# EasyEDA Pro project split-keyboard.eprj

# Schematic Schematic1
Board Name: Left; Create Date: 2025-08-14; Page Name: P1; Project Name: split-keyboard; Schematic Name: Schematic1; Update Date: 2025-09-05; Company: EasyEDA.com; Page Size: A4; Version: V1.0
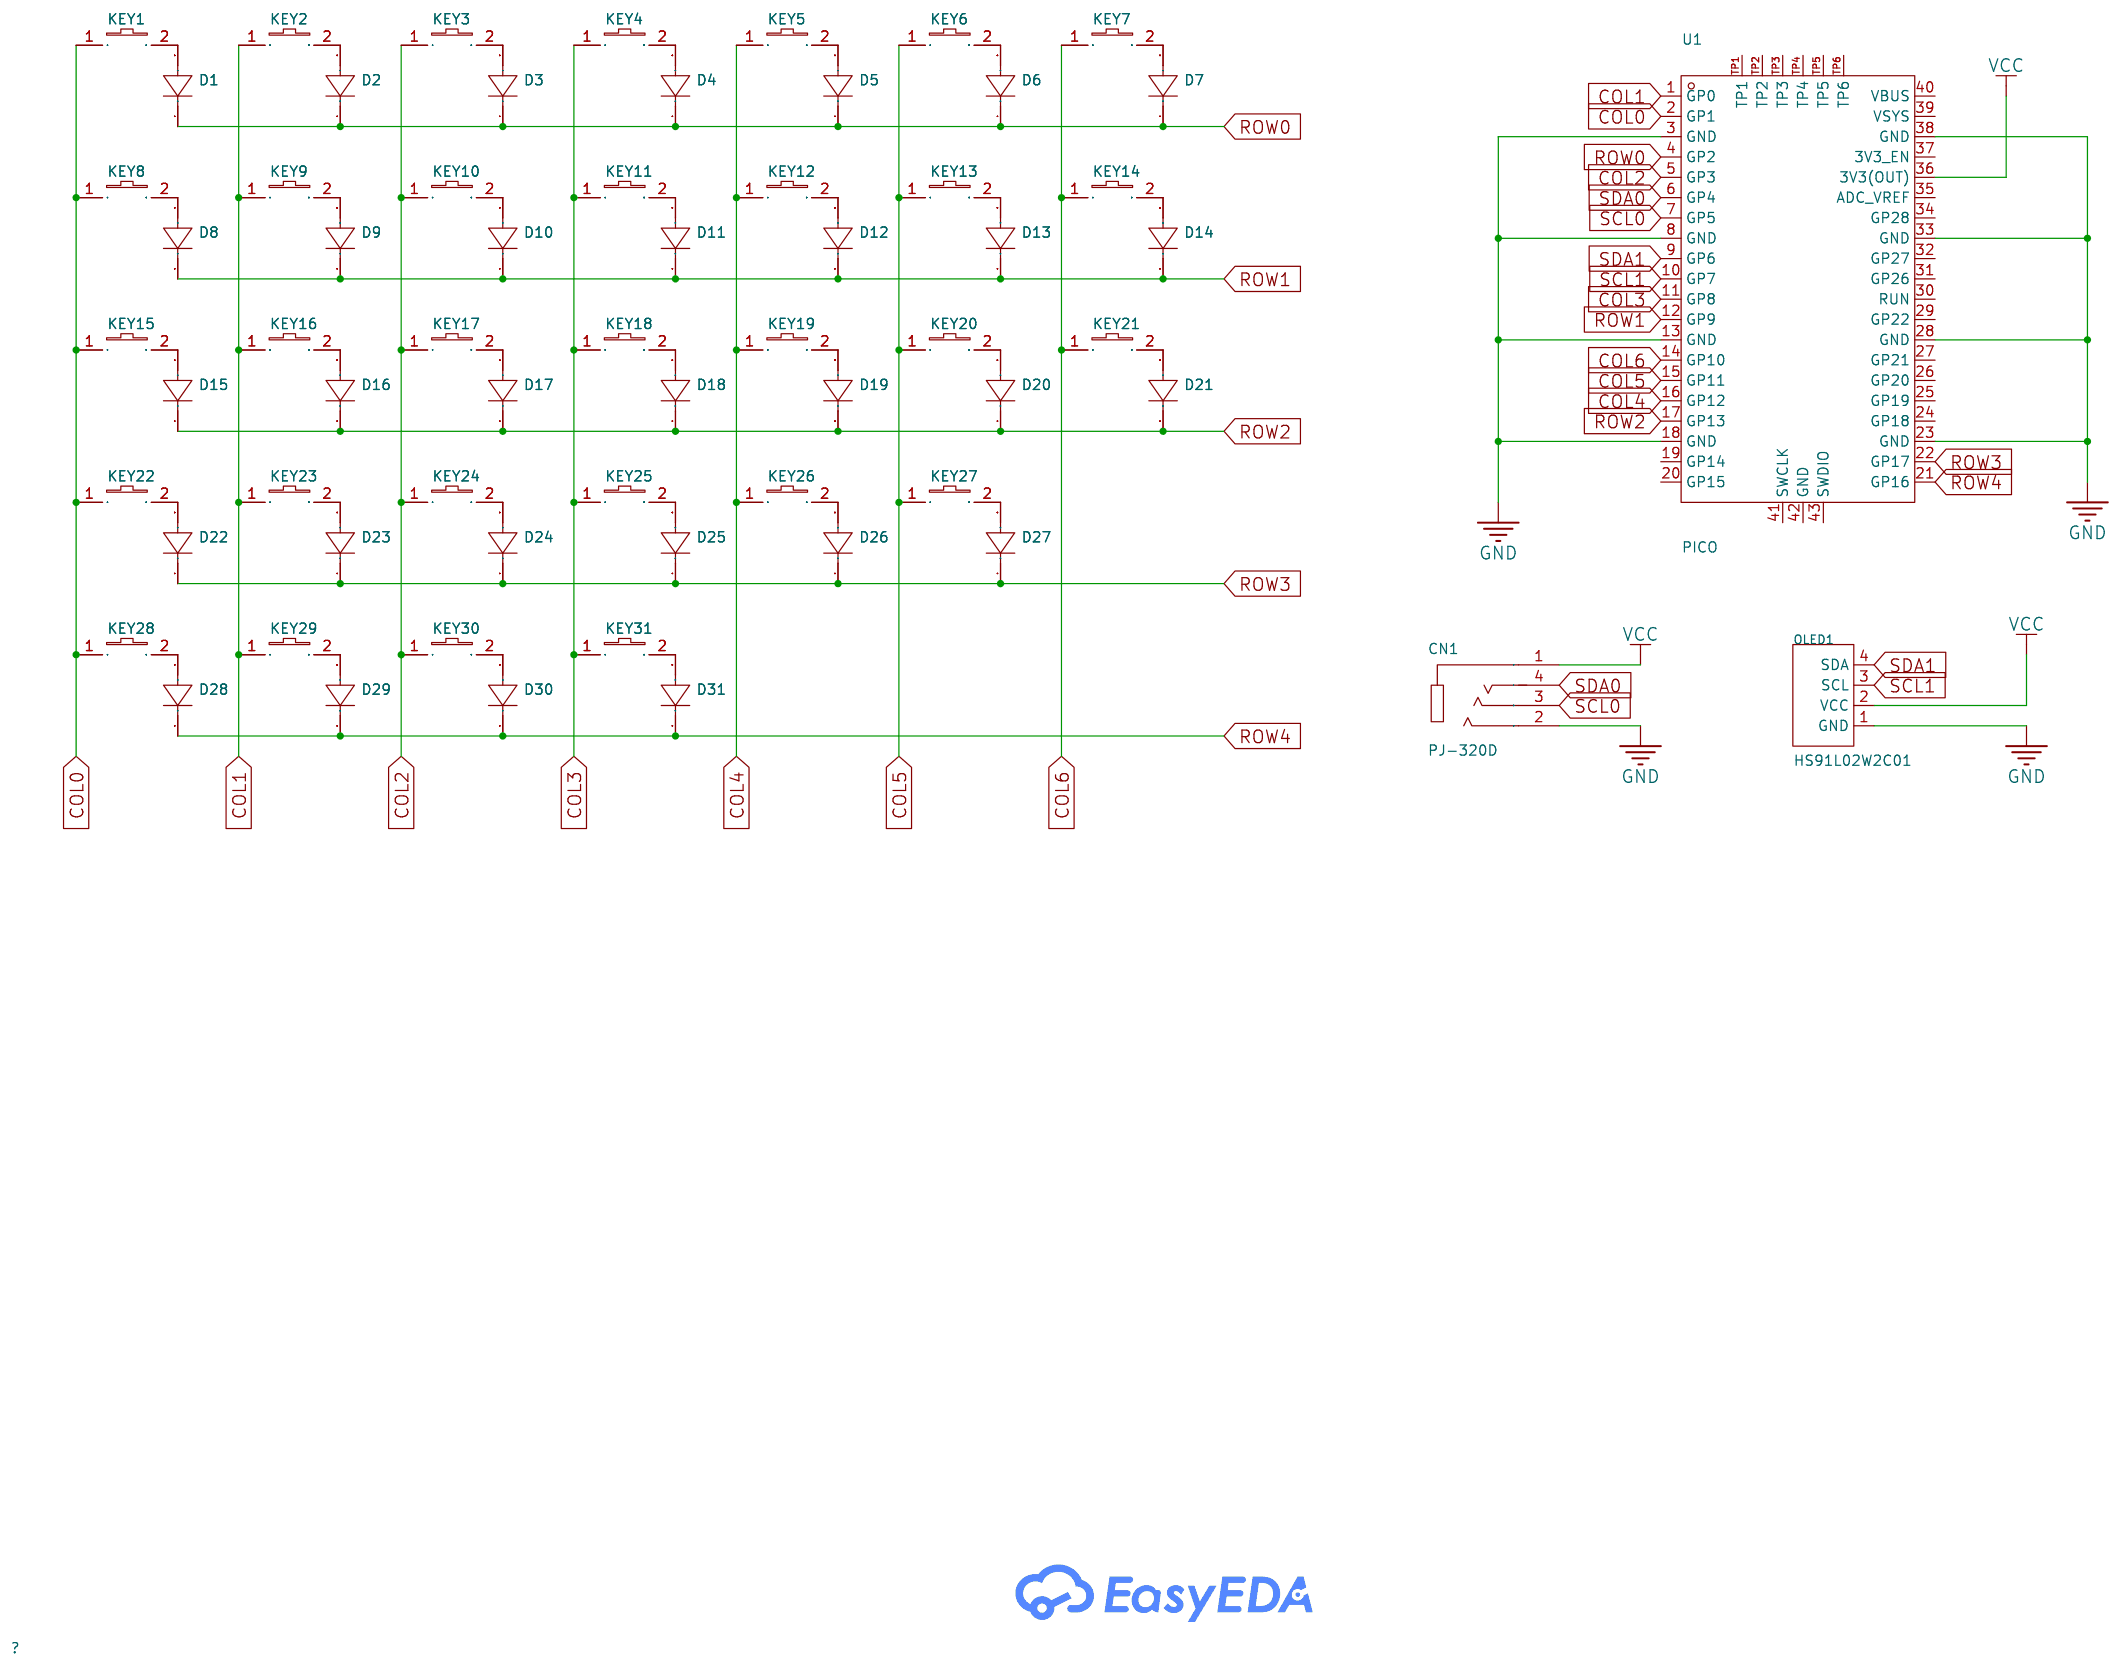
[diagram p0: schematic sheet]

## Parts
CN1  PJ-320D  [AUDIO-SMD_PJ-320D-1]
D1  -  [DO-41_BD2.4-L4.7-P8.70-D0.9-RD]
D2  -  [DO-41_BD2.4-L4.7-P8.70-D0.9-RD]
D3  -  [DO-41_BD2.4-L4.7-P8.70-D0.9-RD]
D4  -  [DO-41_BD2.4-L4.7-P8.70-D0.9-RD]
D5  -  [DO-41_BD2.4-L4.7-P8.70-D0.9-RD]
D6  -  [DO-41_BD2.4-L4.7-P8.70-D0.9-RD]
D7  -  [DO-41_BD2.4-L4.7-P8.70-D0.9-RD]
D8  -  [DO-41_BD2.4-L4.7-P8.70-D0.9-RD]
D9  -  [DO-41_BD2.4-L4.7-P8.70-D0.9-RD]
D10  -  [DO-41_BD2.4-L4.7-P8.70-D0.9-RD]
D11  -  [DO-41_BD2.4-L4.7-P8.70-D0.9-RD]
D12  -  [DO-41_BD2.4-L4.7-P8.70-D0.9-RD]
D13  -  [DO-41_BD2.4-L4.7-P8.70-D0.9-RD]
D14  -  [DO-41_BD2.4-L4.7-P8.70-D0.9-RD]
D15  -  [DO-41_BD2.4-L4.7-P8.70-D0.9-RD]
D16  -  [DO-41_BD2.4-L4.7-P8.70-D0.9-RD]
D17  -  [DO-41_BD2.4-L4.7-P8.70-D0.9-RD]
D18  -  [DO-41_BD2.4-L4.7-P8.70-D0.9-RD]
D19  -  [DO-41_BD2.4-L4.7-P8.70-D0.9-RD]
D20  -  [DO-41_BD2.4-L4.7-P8.70-D0.9-RD]
D21  -  [DO-41_BD2.4-L4.7-P8.70-D0.9-RD]
D22  -  [DO-41_BD2.4-L4.7-P8.70-D0.9-RD]
D23  -  [DO-41_BD2.4-L4.7-P8.70-D0.9-RD]
D24  -  [DO-41_BD2.4-L4.7-P8.70-D0.9-RD]
D25  -  [DO-41_BD2.4-L4.7-P8.70-D0.9-RD]
D26  -  [DO-41_BD2.4-L4.7-P8.70-D0.9-RD]
D27  -  [DO-41_BD2.4-L4.7-P8.70-D0.9-RD]
D28  -  [DO-41_BD2.4-L4.7-P8.70-D0.9-RD]
D29  -  [DO-41_BD2.4-L4.7-P8.70-D0.9-RD]
D30  -  [DO-41_BD2.4-L4.7-P8.70-D0.9-RD]
D31  -  [DO-41_BD2.4-L4.7-P8.70-D0.9-RD]
KEY1  28115182DM  [MX_PCB_1.00u]
KEY2  28115182DM  [MX_PCB_1.00u]
KEY3  28115182DM  [MX_PCB_1.00u]
KEY4  28115182DM  [MX_PCB_1.00u]
KEY5  28115182DM  [MX_PCB_1.00u]
KEY6  28115182DM  [MX_PCB_1.00u]
KEY7  28115182DM  [MX_PCB_1.00u]
KEY8  28115182DM  [MX_PCB_1.00u]
KEY9  28115182DM  [MX_PCB_1.00u]
KEY10  28115182DM  [MX_PCB_1.00u]
KEY11  28115182DM  [MX_PCB_1.00u]
KEY12  28115182DM  [MX_PCB_1.00u]
KEY13  28115182DM  [MX_PCB_1.00u]
KEY14  28115182DM  [MX_PCB_1.00u]
KEY15  28115182DM  [MX_PCB_1.00u]
KEY16  28115182DM  [MX_PCB_1.00u]
KEY17  28115182DM  [MX_PCB_1.00u]
KEY18  28115182DM  [MX_PCB_1.00u]
KEY19  28115182DM  [MX_PCB_1.00u]
KEY20  28115182DM  [MX_PCB_1.00u]
KEY21  28115182DM  [MX_PCB_1.00u]
KEY22  28115182DM  [MX_PCB_1.00u]
KEY23  28115182DM  [MX_PCB_1.00u]
KEY24  28115182DM  [MX_PCB_1.00u]
KEY25  28115182DM  [MX_PCB_1.00u]
KEY26  28115182DM  [MX_PCB_1.00u]
KEY27  28115182DM  [MX_PCB_1.00u]
KEY28  28115182DM  [MX_PCB_1.00u]
KEY29  28115182DM  [MX_PCB_1.00u]
KEY30  28115182DM  [MX_PCB_1.00u]
KEY31  28115182DM  [MX_PCB_1.00u]
OLED1  HS91L02W2C01  [OLED-TH_L38.0-W12.0_HS91L02W2C01]
U1  PICO  [Raspberry_Pi_Pico]

## Library data of the parts
CN1 = PJ-320D_C431535: Connector Type:3.5mm Headphone Jack Current Rating (Max):500mA Voltage Rating (Max):50V Contact Material:Copper Contact Plating:Silver Operating Temperature Range:-30℃~+70℃ Operating Temperature Range:-30℃~+70℃; LCSC Part Name: 3.5mm耳机座; Supplier Part: C431535; Manufacturer: SHOU HAN(首韩); Supplier Footprint: SMD; Datasheet: https://atta.szlcsc.com/upload/public/pdf/source/20190925/C431535_8B274506621F6117FB020BF07A197848.pdf; Supplier: LCSC; Connector Type: 3.5mm Headphone Jack; Current Rating (Max): 500mA; Voltage Rating (Max): 50V; Contact Material: Copper; Contact Plating: Silver; Operating Temperature Range: -30℃~+70℃
D1-D31 = 1N4007: Supplier Footprint: DO-41
KEY1-KEY31 = 28115182DM: Axis Type:水晶轴 Number of Pins:2 Life:5000万次 Operation Force:60gf Conduction Travel:- Voltage Rating:- Operating Temperature:-10℃~+70℃ Operating Temperature:-10℃~+70℃; Supplier Part: C47121945; Manufacturer: SAMZO(三佐); Supplier Footprint: 插件; JLCPCB Part Class: Extended Part; Datasheet: https://atta.szlcsc.com/upload/public/pdf/source/20250402/8399631E7C857A557AEE3DBE24222DC8.pdf; Supplier: LCSC; Axis Type: 水晶轴; Number of Pins: 2; Life: 5000万次; Operation Force: 60gf; Operating Temperature: -10℃~+70℃
OLED1 = HS91L02W2C01: LCSC Part Name: 0.91寸OLED显示屏白光IIC; Supplier Part: C5248081; Manufacturer: HS(汉昇); JLCPCB Part Class: Extended Part; Datasheet: https://atta.szlcsc.com/upload/public/pdf/source/20230727/C3E43C8E3DDA847F5681FEE7D95C153D.pdf; Supplier: LCSC; Main Control Chip: SSD1306; Interface Type: I2C; Size: 0.91; Pixel Resolution: 128x32; Operating Temperature: -40℃~+70℃
U1 = PICO: Supplier Part: C7203002; Manufacturer: Raspberry Pi(树莓派); Datasheet: https://atta.szlcsc.com/upload/public/pdf/source/20230906/086376002DDC9866828648BC93E51F8B.pdf; Supplier: LCSC

## Nets
GND: CN1.2 OLED1.1(GND) U1.3(GND) U1.8(GND) U1.13(GND) U1.18(GND) U1.23(GND) U1.28(GND) U1.33(GND) U1.38(GND)
VCC: CN1.1 OLED1.2(VCC) U1.36(3V3(OUT))
COL0: KEY1.1 KEY8.1 KEY15.1 KEY22.1 KEY28.1 U1.2(GP1)
COL1: KEY2.1 KEY9.1 KEY16.1 KEY23.1 KEY29.1 U1.1(GP0)
COL2: KEY3.1 KEY10.1 KEY17.1 KEY24.1 KEY30.1 U1.5(GP3)
COL3: KEY4.1 KEY11.1 KEY18.1 KEY25.1 KEY31.1 U1.11(GP8)
COL4: KEY5.1 KEY12.1 KEY19.1 KEY26.1 U1.16(GP12)
COL5: KEY6.1 KEY13.1 KEY20.1 KEY27.1 U1.15(GP11)
COL6: KEY7.1 KEY14.1 KEY21.1 U1.14(GP10)
ROW0: D1.1(K) D2.1(K) D3.1(K) D4.1(K) D5.1(K) D6.1(K) D7.1(K) U1.4(GP2)
ROW1: D8.1(K) D9.1(K) D10.1(K) D11.1(K) D12.1(K) D13.1(K) D14.1(K) U1.12(GP9)
ROW2: D15.1(K) D16.1(K) D17.1(K) D18.1(K) D19.1(K) D20.1(K) D21.1(K) U1.17(GP13)
ROW3: D22.1(K) D23.1(K) D24.1(K) D25.1(K) D26.1(K) D27.1(K) U1.22(GP17)
ROW4: D28.1(K) D29.1(K) D30.1(K) D31.1(K) U1.21(GP16)
SCL0: CN1.3 U1.7(GP5)
SCL1: OLED1.3(SCL) U1.10(GP7)
SDA0: CN1.4 U1.6(GP4)
SDA1: OLED1.4(SDA) U1.9(GP6)
$1N158: D1.2(A) KEY1.2
$1N243: D2.2(A) KEY2.2
$1N305: D3.2(A) KEY3.2
$1N549: D4.2(A) KEY4.2
$1N551: D5.2(A) KEY5.2
$1N553: D6.2(A) KEY6.2
$1N987: D7.2(A) KEY7.2
$1N1409: D8.2(A) KEY8.2
$1N1411: D9.2(A) KEY9.2
$1N1413: D10.2(A) KEY10.2
$1N1415: D11.2(A) KEY11.2
$1N1417: D12.2(A) KEY12.2
$1N1419: D13.2(A) KEY13.2
$1N1421: D14.2(A) KEY14.2
$1N1843: D15.2(A) KEY15.2
$1N1845: D16.2(A) KEY16.2
$1N1847: D17.2(A) KEY17.2
$1N1849: D18.2(A) KEY18.2
$1N1851: D19.2(A) KEY19.2
$1N1853: D20.2(A) KEY20.2
$1N1855: D21.2(A) KEY21.2
$1N2217: D22.2(A) KEY22.2
$1N2219: D23.2(A) KEY23.2
$1N2221: D24.2(A) KEY24.2
$1N2223: D25.2(A) KEY25.2
$1N2225: D26.2(A) KEY26.2
$1N2227: D27.2(A) KEY27.2
$1N2529: D28.2(A) KEY28.2
$1N2531: D29.2(A) KEY29.2
$1N4626: D30.2(A) KEY30.2
$1N4628: D31.2(A) KEY31.2

Not connected (* = marked no-connect by the designer): U1 19(GP14) 20(GP15) 24(GP18) 25(GP19) 26(GP20) 27(GP21) 29(GP22) 30(RUN) 31(GP26) 32(GP27) 34(GP28) 35(ADC_VREF) 37(3V3_EN) 39(VSYS) 40(VBUS) 41(SWCLK) 42(GND) 43(SWDIO) TP1 TP2 TP3 TP4 TP5 TP6

# Schematic Schematic2
Board Name: Right; Create Date: 2025-09-15; Page Name: P1; Project Name: split-keyboard; Schematic Name: Schematic2; Update Date: 2025-09-16; Company: EasyEDA.com; Page Size: A4; Version: V1.0
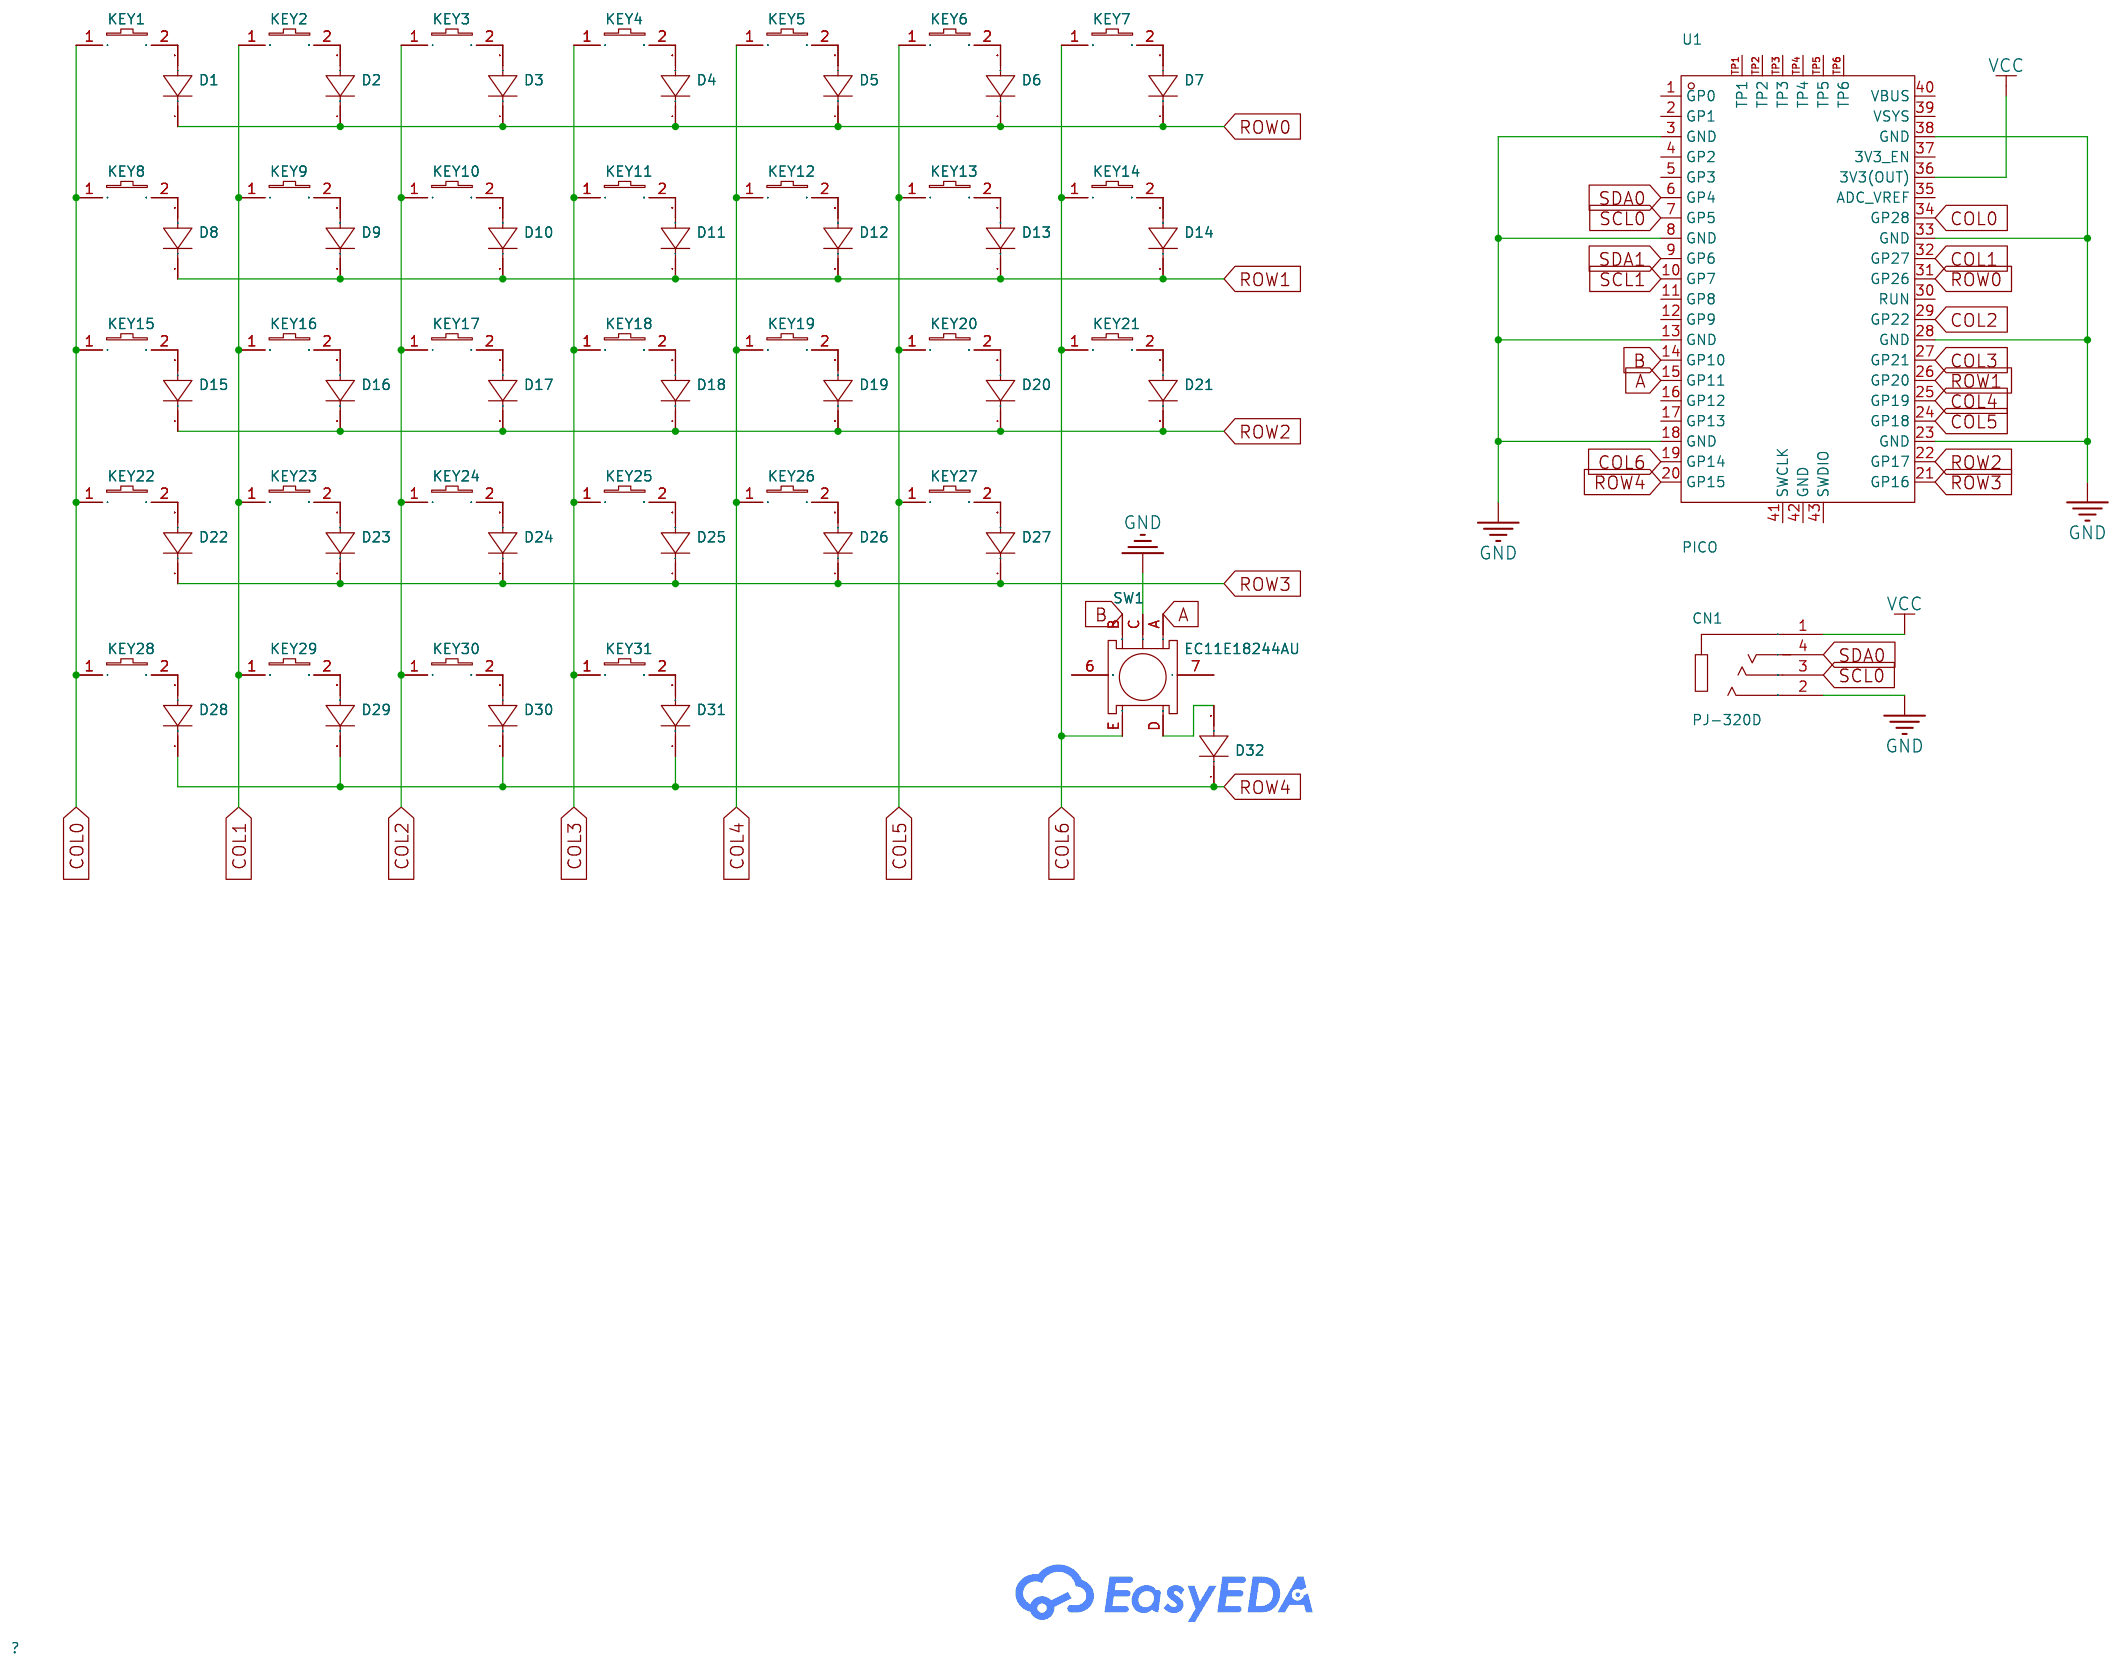
[diagram p1: schematic sheet]

## Parts
CN1  PJ-320D  [AUDIO-SMD_PJ-320D-1]
D1  -  [DO-41_BD2.4-L4.7-P8.70-D0.9-RD]
D2  -  [DO-41_BD2.4-L4.7-P8.70-D0.9-RD]
D3  -  [DO-41_BD2.4-L4.7-P8.70-D0.9-RD]
D4  -  [DO-41_BD2.4-L4.7-P8.70-D0.9-RD]
D5  -  [DO-41_BD2.4-L4.7-P8.70-D0.9-RD]
D6  -  [DO-41_BD2.4-L4.7-P8.70-D0.9-RD]
D7  -  [DO-41_BD2.4-L4.7-P8.70-D0.9-RD]
D8  -  [DO-41_BD2.4-L4.7-P8.70-D0.9-RD]
D9  -  [DO-41_BD2.4-L4.7-P8.70-D0.9-RD]
D10  -  [DO-41_BD2.4-L4.7-P8.70-D0.9-RD]
D11  -  [DO-41_BD2.4-L4.7-P8.70-D0.9-RD]
D12  -  [DO-41_BD2.4-L4.7-P8.70-D0.9-RD]
D13  -  [DO-41_BD2.4-L4.7-P8.70-D0.9-RD]
D14  -  [DO-41_BD2.4-L4.7-P8.70-D0.9-RD]
D15  -  [DO-41_BD2.4-L4.7-P8.70-D0.9-RD]
D16  -  [DO-41_BD2.4-L4.7-P8.70-D0.9-RD]
D17  -  [DO-41_BD2.4-L4.7-P8.70-D0.9-RD]
D18  -  [DO-41_BD2.4-L4.7-P8.70-D0.9-RD]
D19  -  [DO-41_BD2.4-L4.7-P8.70-D0.9-RD]
D20  -  [DO-41_BD2.4-L4.7-P8.70-D0.9-RD]
D21  -  [DO-41_BD2.4-L4.7-P8.70-D0.9-RD]
D22  -  [DO-41_BD2.4-L4.7-P8.70-D0.9-RD]
D23  -  [DO-41_BD2.4-L4.7-P8.70-D0.9-RD]
D24  -  [DO-41_BD2.4-L4.7-P8.70-D0.9-RD]
D25  -  [DO-41_BD2.4-L4.7-P8.70-D0.9-RD]
D26  -  [DO-41_BD2.4-L4.7-P8.70-D0.9-RD]
D27  -  [DO-41_BD2.4-L4.7-P8.70-D0.9-RD]
D28  -  [DO-41_BD2.4-L4.7-P8.70-D0.9-RD]
D29  -  [DO-41_BD2.4-L4.7-P8.70-D0.9-RD]
D30  -  [DO-41_BD2.4-L4.7-P8.70-D0.9-RD]
D31  -  [DO-41_BD2.4-L4.7-P8.70-D0.9-RD]
D32  -  [DO-41_BD2.4-L4.7-P8.70-D0.9-RD]
KEY1  28115182DM  [MX_PCB_1.00u]
KEY2  28115182DM  [MX_PCB_1.00u]
KEY3  28115182DM  [MX_PCB_1.00u]
KEY4  28115182DM  [MX_PCB_1.00u]
KEY5  28115182DM  [MX_PCB_1.00u]
KEY6  28115182DM  [MX_PCB_1.00u]
KEY7  28115182DM  [MX_PCB_1.00u]
KEY8  28115182DM  [MX_PCB_1.00u]
KEY9  28115182DM  [MX_PCB_1.00u]
KEY10  28115182DM  [MX_PCB_1.00u]
KEY11  28115182DM  [MX_PCB_1.00u]
KEY12  28115182DM  [MX_PCB_1.00u]
KEY13  28115182DM  [MX_PCB_1.00u]
KEY14  28115182DM  [MX_PCB_1.00u]
KEY15  28115182DM  [MX_PCB_1.00u]
KEY16  28115182DM  [MX_PCB_1.00u]
KEY17  28115182DM  [MX_PCB_1.00u]
KEY18  28115182DM  [MX_PCB_1.00u]
KEY19  28115182DM  [MX_PCB_1.00u]
KEY20  28115182DM  [MX_PCB_1.00u]
KEY21  28115182DM  [MX_PCB_1.00u]
KEY22  28115182DM  [MX_PCB_1.00u]
KEY23  28115182DM  [MX_PCB_1.00u]
KEY24  28115182DM  [MX_PCB_1.00u]
KEY25  28115182DM  [MX_PCB_1.00u]
KEY26  28115182DM  [MX_PCB_1.00u]
KEY27  28115182DM  [MX_PCB_1.00u]
KEY28  28115182DM  [MX_PCB_1.00u]
KEY29  28115182DM  [MX_PCB_1.00u]
KEY30  28115182DM  [MX_PCB_1.00u]
KEY31  28115182DM  [MX_PCB_1.00u]
SW1  EC11E18244AU  [SW-TH_EC11XXXXXXXX]
U1  PICO  [Raspberry_Pi_Pico]

## Library data of the parts
CN1 = PJ-320D_C431535: Connector Type:3.5mm Headphone Jack Current Rating (Max):500mA Voltage Rating (Max):50V Contact Material:Copper Contact Plating:Silver Operating Temperature Range:-30℃~+70℃ Operating Temperature Range:-30℃~+70℃; LCSC Part Name: 3.5mm耳机座; Supplier Part: C431535; Manufacturer: SHOU HAN(首韩); Supplier Footprint: SMD; Datasheet: https://atta.szlcsc.com/upload/public/pdf/source/20190925/C431535_8B274506621F6117FB020BF07A197848.pdf; Supplier: LCSC; Connector Type: 3.5mm Headphone Jack; Current Rating (Max): 500mA; Voltage Rating (Max): 50V; Contact Material: Copper; Contact Plating: Silver; Operating Temperature Range: -30℃~+70℃
D1-D32 = 1N4007: Supplier Footprint: DO-41
KEY1-KEY31 = 28115182DM: Axis Type:水晶轴 Number of Pins:2 Life:5000万次 Operation Force:60gf Conduction Travel:- Voltage Rating:- Operating Temperature:-10℃~+70℃ Operating Temperature:-10℃~+70℃; Supplier Part: C47121945; Manufacturer: SAMZO(三佐); Supplier Footprint: 插件; JLCPCB Part Class: Extended Part; Datasheet: https://atta.szlcsc.com/upload/public/pdf/source/20250402/8399631E7C857A557AEE3DBE24222DC8.pdf; Supplier: LCSC; Axis Type: 水晶轴; Number of Pins: 2; Life: 5000万次; Operation Force: 60gf; Operating Temperature: -10℃~+70℃
SW1 = EC11E18244AU: Supplier Part: C202365; Manufacturer: ALPSALPINE(阿尔卑斯阿尔派); Supplier Footprint: 插件; Datasheet: https://atta.szlcsc.com/upload/public/pdf/source/20180403/C202365_70FA927E879F562641EADC151E1E414A.pdf; Supplier: LCSC
U1 = PICO: Supplier Part: C7203002; Manufacturer: Raspberry Pi(树莓派); Datasheet: https://atta.szlcsc.com/upload/public/pdf/source/20230906/086376002DDC9866828648BC93E51F8B.pdf; Supplier: LCSC

## Nets
GND: CN1.2 SW1.C U1.3(GND) U1.8(GND) U1.13(GND) U1.18(GND) U1.23(GND) U1.28(GND) U1.33(GND) U1.38(GND)
VCC: CN1.1 U1.36(3V3(OUT))
A: SW1.A U1.15(GP11)
B: SW1.B U1.14(GP10)
COL0: KEY1.1 KEY8.1 KEY15.1 KEY22.1 KEY28.1 U1.34(GP28)
COL1: KEY2.1 KEY9.1 KEY16.1 KEY23.1 KEY29.1 U1.32(GP27)
COL2: KEY3.1 KEY10.1 KEY17.1 KEY24.1 KEY30.1 U1.29(GP22)
COL3: KEY4.1 KEY11.1 KEY18.1 KEY25.1 KEY31.1 U1.27(GP21)
COL4: KEY5.1 KEY12.1 KEY19.1 KEY26.1 U1.25(GP19)
COL5: KEY6.1 KEY13.1 KEY20.1 KEY27.1 U1.24(GP18)
COL6: KEY7.1 KEY14.1 KEY21.1 SW1.E U1.19(GP14)
ROW0: D1.1(K) D2.1(K) D3.1(K) D4.1(K) D5.1(K) D6.1(K) D7.1(K) U1.31(GP26)
ROW1: D8.1(K) D9.1(K) D10.1(K) D11.1(K) D12.1(K) D13.1(K) D14.1(K) U1.26(GP20)
ROW2: D15.1(K) D16.1(K) D17.1(K) D18.1(K) D19.1(K) D20.1(K) D21.1(K) U1.22(GP17)
ROW3: D22.1(K) D23.1(K) D24.1(K) D25.1(K) D26.1(K) D27.1(K) U1.21(GP16)
ROW4: D28.1(K) D29.1(K) D30.1(K) D31.1(K) D32.1(K) U1.20(GP15)
SCL0: CN1.3 U1.7(GP5)
SCL1: U1.10(GP7)
SDA0: CN1.4 U1.6(GP4)
SDA1: U1.9(GP6)
$1N158: D1.2(A) KEY1.2
$1N243: D2.2(A) KEY2.2
$1N305: D3.2(A) KEY3.2
$1N549: D4.2(A) KEY4.2
$1N551: D5.2(A) KEY5.2
$1N553: D6.2(A) KEY6.2
$1N987: D7.2(A) KEY7.2
$1N1409: D8.2(A) KEY8.2
$1N1411: D9.2(A) KEY9.2
$1N1413: D10.2(A) KEY10.2
$1N1415: D11.2(A) KEY11.2
$1N1417: D12.2(A) KEY12.2
$1N1419: D13.2(A) KEY13.2
$1N1421: D14.2(A) KEY14.2
$1N1843: D15.2(A) KEY15.2
$1N1845: D16.2(A) KEY16.2
$1N1847: D17.2(A) KEY17.2
$1N1849: D18.2(A) KEY18.2
$1N1851: D19.2(A) KEY19.2
$1N1853: D20.2(A) KEY20.2
$1N1855: D21.2(A) KEY21.2
$1N2217: D22.2(A) KEY22.2
$1N2219: D23.2(A) KEY23.2
$1N2221: D24.2(A) KEY24.2
$1N2223: D25.2(A) KEY25.2
$1N2225: D26.2(A) KEY26.2
$1N2227: D27.2(A) KEY27.2
$1N2529: D28.2(A) KEY28.2
$1N2531: D29.2(A) KEY29.2
$1N4626: D30.2(A) KEY30.2
$1N4628: D31.2(A) KEY31.2
$1N26639: D32.2(A) SW1.D

Not connected (* = marked no-connect by the designer): SW1 6 7; U1 1(GP0) 2(GP1) 4(GP2) 5(GP3) 11(GP8) 12(GP9) 16(GP12) 17(GP13) 30(RUN) 35(ADC_VREF) 37(3V3_EN) 39(VSYS) 40(VBUS) 41(SWCLK) 42(GND) 43(SWDIO) TP1 TP2 TP3 TP4 TP5 TP6

# Board PCB2
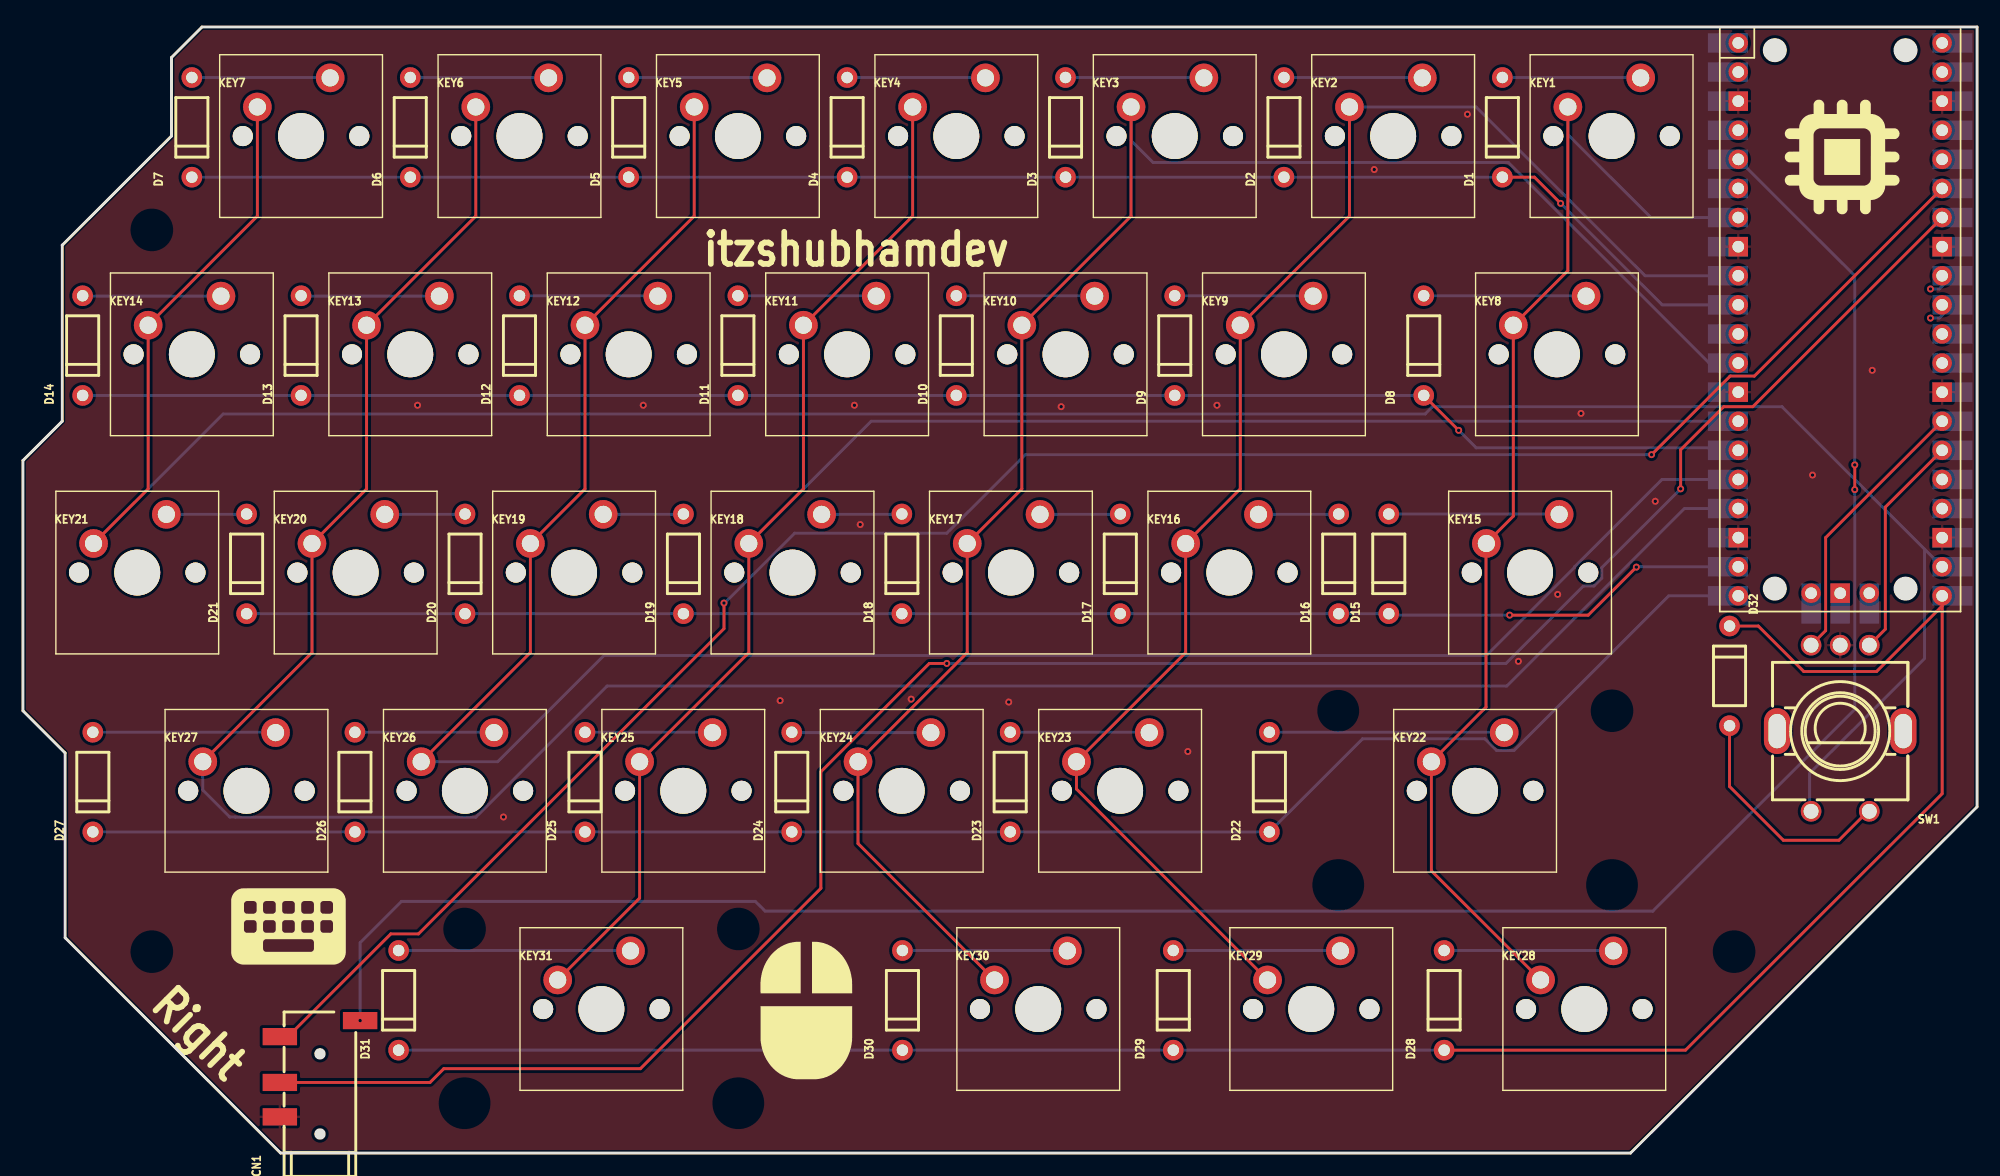
[diagram p2: board, top side]
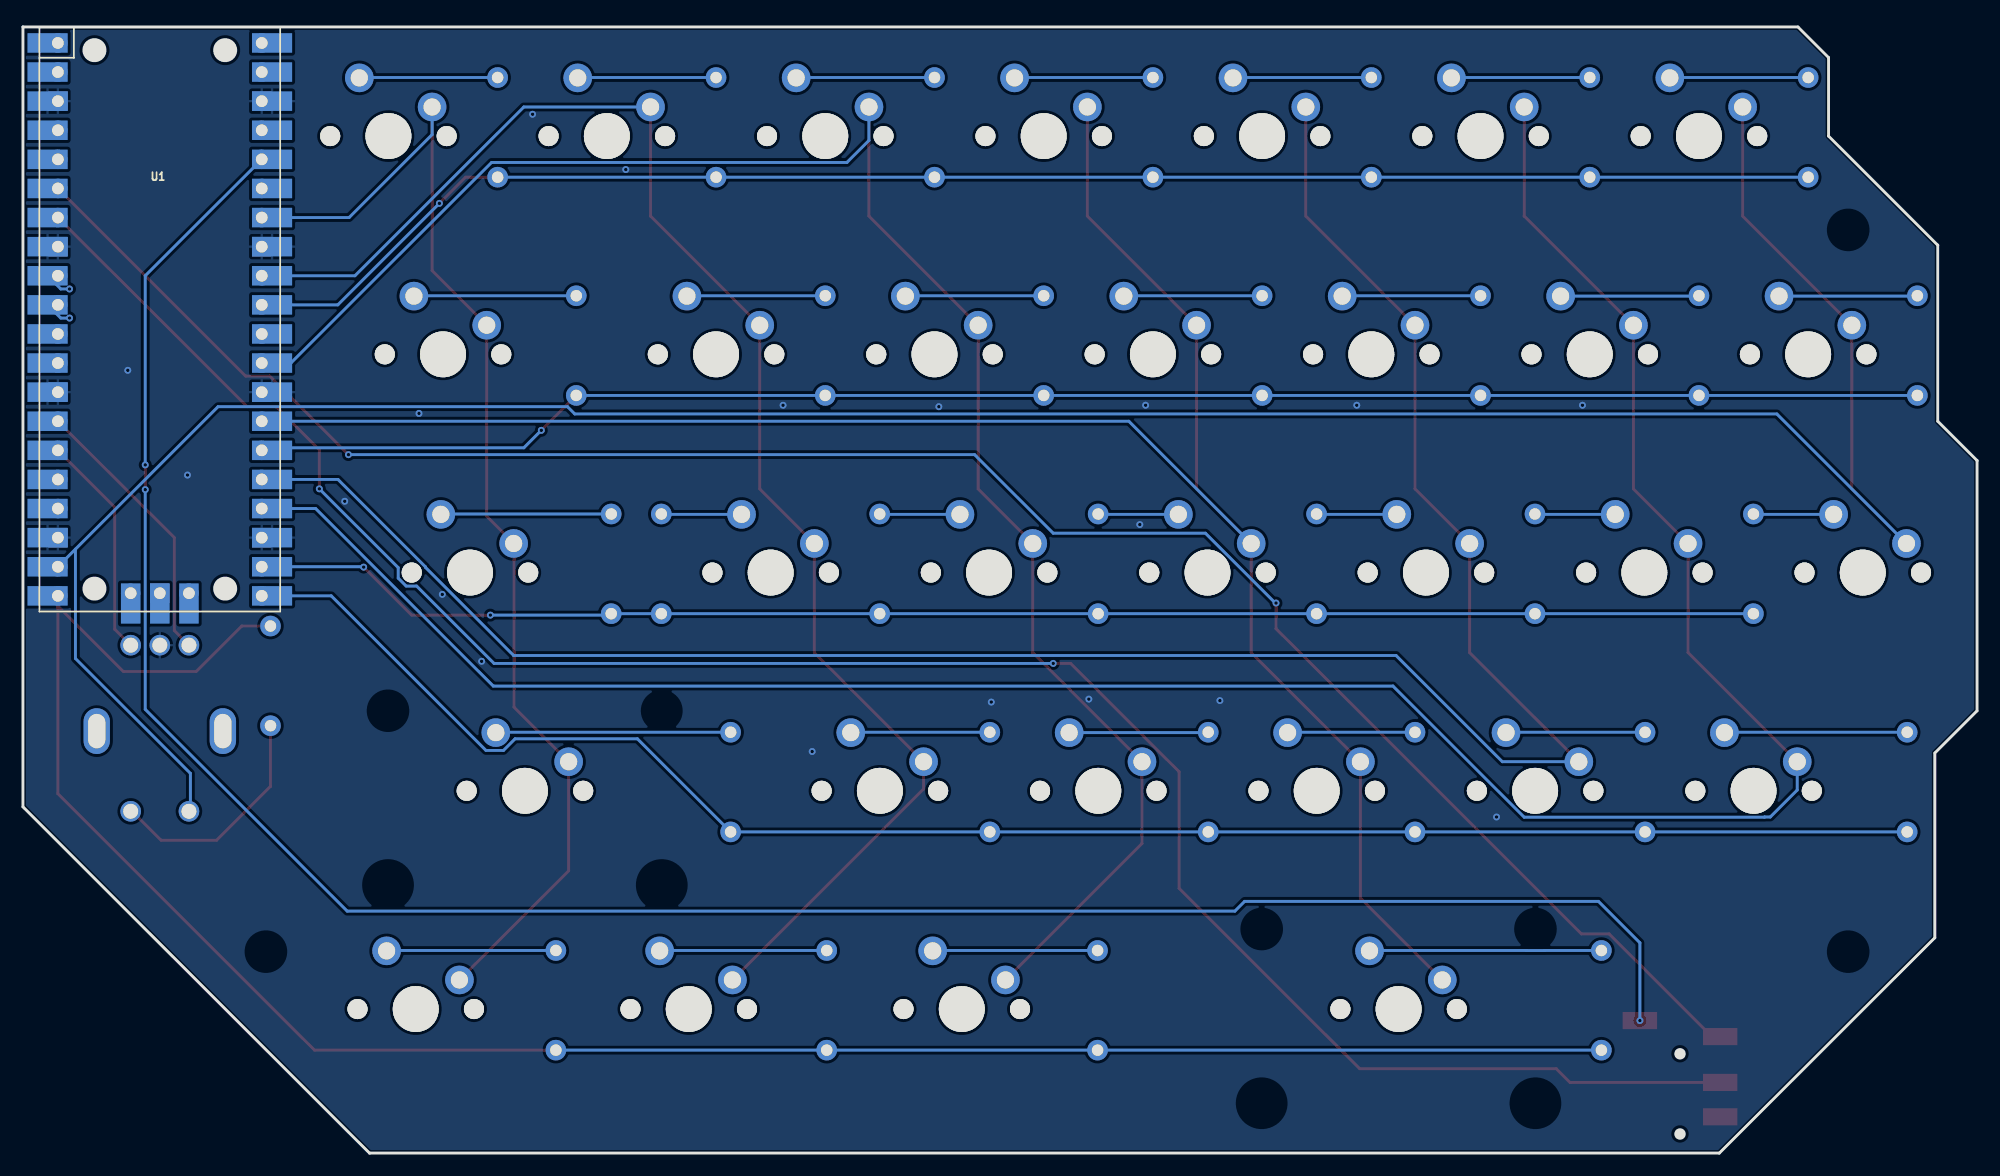
[diagram p3: board, bottom side, seen from below]

Outline 170.43 x 98.3 mm; copper layers: Top Layer, Bottom Layer. Coordinates in mm from the lower left corner of the outline.
Outline path: 0,60.45 0,38.61 3.68,34.92 3.68,18.8 22.48,0 140.21,0 170.43,30.23 170.43,98.3 15.62,98.3 12.95,95.63 12.95,88.77 3.43,79.25 3.43,63.88 0,60.45
Stack: Top Layer 0.035mm / Dielectric1 1.51mm FR4 er 4.5 / Bottom Layer 0.035mm

## Design rules (mm)
template: JLCPCB Capability(Two Layers Board)
spacing copperThickness1oz (default): track to track 0.102, other pairs 0.152 to 0.3
spacing copperThickness2oz: track to track 0.203, other pairs 0.152 to 0.3
track width copperThickness1oz (default): min 0.127, default 0.254, max 2.54
track width copperThickness2oz: min 0.203, default 0.254, max 2.54
differential pair differentialPair (default): width min 0.127, default 0.254, max 2.54; gap min 0.152, default 0.152
via viaSize (default): diameter min 0.5, default 0.61, max 10; hole min 0.3, default 0.305, max 6.3

## Placement (name value [footprint] x y rotation side)
CN1  PJ-320D  [AUDIO-SMD_PJ-320D-1]  25.91 7.37 90 top
D1  -  [DO-41_BD2.4-L4.7-P8.70-D0.9-RD]  129.03 89.53 90 top
D2  -  [DO-41_BD2.4-L4.7-P8.70-D0.9-RD]  109.98 89.53 90 top
D3  -  [DO-41_BD2.4-L4.7-P8.70-D0.9-RD]  90.93 89.53 90 top
D4  -  [DO-41_BD2.4-L4.7-P8.70-D0.9-RD]  71.88 89.53 90 top
D5  -  [DO-41_BD2.4-L4.7-P8.70-D0.9-RD]  52.83 89.53 90 top
D6  -  [DO-41_BD2.4-L4.7-P8.70-D0.9-RD]  33.78 89.53 90 top
D7  -  [DO-41_BD2.4-L4.7-P8.70-D0.9-RD]  14.73 89.53 90 top
D8  -  [DO-41_BD2.4-L4.7-P8.70-D0.9-RD]  122.17 70.48 90 top
D9  -  [DO-41_BD2.4-L4.7-P8.70-D0.9-RD]  100.46 70.48 90 top
D10  -  [DO-41_BD2.4-L4.7-P8.70-D0.9-RD]  81.41 70.48 90 top
D11  -  [DO-41_BD2.4-L4.7-P8.70-D0.9-RD]  62.36 70.48 90 top
D12  -  [DO-41_BD2.4-L4.7-P8.70-D0.9-RD]  43.31 70.48 90 top
D13  -  [DO-41_BD2.4-L4.7-P8.70-D0.9-RD]  24.26 70.48 90 top
D14  -  [DO-41_BD2.4-L4.7-P8.70-D0.9-RD]  5.21 70.48 90 top
D15  -  [DO-41_BD2.4-L4.7-P8.70-D0.9-RD]  119.13 51.44 90 top
D16  -  [DO-41_BD2.4-L4.7-P8.70-D0.9-RD]  114.76 51.44 90 top
D17  -  [DO-41_BD2.4-L4.7-P8.70-D0.9-RD]  95.71 51.44 90 top
D18  -  [DO-41_BD2.4-L4.7-P8.70-D0.9-RD]  76.66 51.44 90 top
D19  -  [DO-41_BD2.4-L4.7-P8.70-D0.9-RD]  57.61 51.44 90 top
D20  -  [DO-41_BD2.4-L4.7-P8.70-D0.9-RD]  38.56 51.44 90 top
D21  -  [DO-41_BD2.4-L4.7-P8.70-D0.9-RD]  19.51 51.44 90 top
D22  -  [DO-41_BD2.4-L4.7-P8.70-D0.9-RD]  108.71 32.39 90 top
D23  -  [DO-41_BD2.4-L4.7-P8.70-D0.9-RD]  86.11 32.39 90 top
D24  -  [DO-41_BD2.4-L4.7-P8.70-D0.9-RD]  67.06 32.39 90 top
D25  -  [DO-41_BD2.4-L4.7-P8.70-D0.9-RD]  49.02 32.39 90 top
D26  -  [DO-41_BD2.4-L4.7-P8.70-D0.9-RD]  28.96 32.39 90 top
D27  -  [DO-41_BD2.4-L4.7-P8.70-D0.9-RD]  6.1 32.39 90 top
D28  -  [DO-41_BD2.4-L4.7-P8.70-D0.9-RD]  123.95 13.34 90 top
D29  -  [DO-41_BD2.4-L4.7-P8.70-D0.9-RD]  100.33 13.34 90 top
D30  -  [DO-41_BD2.4-L4.7-P8.70-D0.9-RD]  76.71 13.34 90 top
D31  -  [DO-41_BD2.4-L4.7-P8.70-D0.9-RD]  32.77 13.34 90 top
D32  -  [DO-41_BD2.4-L4.7-P8.70-D0.9-RD]  148.84 41.66 270 top
KEY1  28115182DM  [MX_PCB_1.00u]  138.56 88.77 0 top
KEY2  28115182DM  [MX_PCB_1.00u]  119.51 88.77 0 top
KEY3  28115182DM  [MX_PCB_1.00u]  100.46 88.77 0 top
KEY4  28115182DM  [MX_PCB_1.00u]  81.41 88.77 0 top
KEY5  28115182DM  [MX_PCB_1.00u]  62.36 88.77 0 top
KEY6  28115182DM  [MX_PCB_1.00u]  43.31 88.77 0 top
KEY7  28115182DM  [MX_PCB_1.00u]  24.26 88.77 0 top
KEY8  28115182DM  [MX_PCB_1.00u]  133.79 69.72 0 top
KEY9  28115182DM  [MX_PCB_1.00u]  109.98 69.72 0 top
KEY10  28115182DM  [MX_PCB_1.00u]  90.93 69.72 0 top
KEY11  28115182DM  [MX_PCB_1.00u]  71.88 69.72 0 top
KEY12  28115182DM  [MX_PCB_1.00u]  52.83 69.72 0 top
KEY13  28115182DM  [MX_PCB_1.00u]  33.78 69.72 0 top
KEY14  28115182DM  [MX_PCB_1.00u]  14.73 69.72 0 top
KEY15  28115182DM  [MX_PCB_1.00u]  131.44 50.67 0 top
KEY16  28115182DM  [MX_PCB_1.00u]  105.22 50.67 0 top
KEY17  28115182DM  [MX_PCB_1.00u]  86.17 50.67 0 top
KEY18  28115182DM  [MX_PCB_1.00u]  67.12 50.67 0 top
KEY19  28115182DM  [MX_PCB_1.00u]  48.07 50.67 0 top
KEY20  28115182DM  [MX_PCB_1.00u]  29.02 50.67 0 top
KEY21  28115182DM  [MX_PCB_1.00u]  9.97 50.67 0 top
KEY22  28115182DM  [MX_PCB_1.00u]  126.65 31.62 0 top
KEY23  28115182DM  [MX_PCB_1.00u]  95.69 31.62 0 top
KEY24  28115182DM  [MX_PCB_1.00u]  76.64 31.62 0 top
KEY25  28115182DM  [MX_PCB_1.00u]  57.59 31.62 0 top
KEY26  28115182DM  [MX_PCB_1.00u]  38.54 31.62 0 top
KEY27  28115182DM  [MX_PCB_1.00u]  19.49 31.62 0 top
KEY28  28115182DM  [MX_PCB_1.00u]  136.18 12.57 0 top
KEY29  28115182DM  [MX_PCB_1.00u]  112.36 12.57 0 top
KEY30  28115182DM  [MX_PCB_1.00u]  88.55 12.57 0 top
KEY31  28115182DM  [MX_PCB_1.00u]  50.45 12.57 0 top
SW1  EC11E18244AU  [SW-TH_EC11XXXXXXXX]  158.5 37.08 180 top
U1  PICO  [Raspberry_Pi_Pico]  158.5 72.77 180 bottom

## Footprints (pads in the part's own frame, mm; a bottom-side part is the same pattern mirrored in y, then rotated)
AUDIO-SMD_PJ-320D-1
  rect 1.5x3 smd: 1(4.2,-3.5) 2(-4.2,3.5) 3(-1.2,3.5) 4(2.8,3.5)
DO-41_BD2.4-L4.7-P8.70-D0.9-RD
  round 1.8 hole 1: 1(-4.35,0) 2(4.35,0)
MX_PCB_1.00u
  round 1.75 hole 1.75: (-5.08,0) (5.08,0)
  round 4 hole 4: (0,0)
  round 2.5 hole 1.5: 1(-3.81,2.54) 2(2.54,5.08)
Raspberry_Pi_Pico
  rect 3.5x1.7 smd: 1(-9.79,24.13) 2(-9.79,21.59) 3(-9.79,19.05) 4(-9.79,16.51) 5(-9.79,13.97) 6(-9.79,11.43) 7(-9.79,8.89) 8(-9.79,6.35) 9(-9.79,3.81) 10(-9.79,1.27) 11(-9.79,-1.27) 12(-9.79,-3.81) 13(-9.79,-6.35) 14(-9.79,-8.89) 15(-9.79,-11.43) 16(-9.79,-13.97) 17(-9.79,-16.51) 18(-9.79,-19.05) 19(-9.79,-21.59) 20(-9.79,-24.13) 21(9.79,-24.13) 22(9.79,-21.59) 23(9.79,-19.05) 24(9.79,-16.51) 25(9.79,-13.97) 26(9.79,-11.43) 27(9.79,-8.89) 28(9.79,-6.35) 29(9.79,-3.81) 30(9.79,-1.27) 31(9.79,1.27) 32(9.79,3.81) 33(9.79,6.35) 34(9.79,8.89) 35(9.79,11.43) 36(9.79,13.97) 37(9.79,16.51) 38(9.79,19.05) 39(9.79,21.59) 40(9.79,24.13)
  round 1.7 hole 1.02: 1(-8.89,24.13) 2(-8.89,21.59) 4(-8.89,16.51) 5(-8.89,13.97) 6(-8.89,11.43) 7(-8.89,8.89) 9(-8.89,3.81) 10(-8.89,1.27) 11(-8.89,-1.27) 12(-8.89,-3.81) 14(-8.89,-8.89) 15(-8.89,-11.43) 16(-8.89,-13.97) 17(-8.89,-16.51) 19(-8.89,-21.59) 20(-8.89,-24.13) 21(8.89,-24.13) 22(8.89,-21.59) 24(8.89,-16.51) 25(8.89,-13.97) 26(8.89,-11.43) 27(8.89,-8.89) 29(8.89,-3.81) 30(8.89,-1.27) 31(8.89,1.27) 32(8.89,3.81) 34(8.89,8.89) 35(8.89,11.43) 36(8.89,13.97) 37(8.89,16.51) 39(8.89,21.59) 40(8.89,24.13) 41(-2.54,-23.9) 43(2.54,-23.9)
  rect 1.7x1.7 hole 1.02: 3(-8.89,19.05) 8(-8.89,6.35) 13(-8.89,-6.35) 18(-8.89,-19.05) 23(8.89,-19.05) 28(8.89,-6.35) 33(8.89,6.35) 38(8.89,19.05) 42(0,-23.9)
  rect 1.7x3.5 smd: 41(-2.54,-24.8) 42(0,-24.8) 43(2.54,-24.8)
SW-TH_EC11XXXXXXXX
  oval 2.3x4 hole 1.5x3: 6(5.5,0.25) 7(-5.5,0.25)
  round 1.8 hole 1.3: A(-2.54,-7.25) B(2.54,-7.25) C(0,-7.25) D(-2.54,7.25) E(2.54,7.25)

## Nets
As in the schematic.

Pads without a net: SW1 6 7; U1 1 2 4 5 11 12 16 17 30 35 37 39 40 41 42 43

## Via types
v1: diameter 0.61, hole 0.305, Top Layer to Bottom Layer, 32 vias

## Routing (per net, layer and track width the routed paths; a pad name or vN(x,y) marks a point on that pad's centre or on a via; arc(x,y) is an arc through that point)
GND:
  vias: v1(34.42,65.28) v1(41.91,29.34) v1(54.1,65.28) v1(66.04,39.5) v1(72.52,65.28) v1(73.02,54.86) v1(77.47,39.62) v1(85.98,39.37) v1(90.55,65.15) v1(101.6,35.05) v1(104.14,65.28) v1(117.86,85.85) v1(125.98,90.68) v1(130.43,42.93) v1(133.86,48.77) v1(135.89,64.57) v1(142.37,56.9) v1(156.08,59.18) v1(161.29,68.33)
VCC: length 199.4
  Top Layer w0.254: v1(159.77,57.91) v1(159.77,60.07)
  Bottom Layer w0.254: v1(159.77,60.07) 159.77,76.58 U1.36 U1.36 ; v1(159.77,57.91) 159.77,38.73 142.15,21.12 64.73,21.12 63.88,21.97 33.02,21.97 29.41,18.36 v1(29.41,11.57)
A: length 19.6
  Top Layer w0.254: U1.15 162.43,56.39 162.43,45.73 SW1.A
B: length 24.3
  Top Layer w0.254: U1.14 157.23,53.72 157.23,45.6 SW1.B
COL0: length 105.3
  Top Layer w0.254: KEY1.1 134.75,77.03 KEY8.1 129.98,55.59 127.6,53.21 127.6,38.93 KEY22.1 122.84,24.64 KEY28.1
  Bottom Layer w0.254: U1.34 141.99,81.66 134.75,88.9 KEY1.1
COL1: length 133
  Top Layer w0.254: 115.7,91.31 115.7,81.79 KEY9.1 106.17,57.98 KEY16.1 101.41,43.69 KEY23.1 91.88,31.78 KEY29.1
  Bottom Layer w0.254: U1.32 141.48,76.58 126.75,91.31 115.7,91.31
COL2: length 154.9
  Top Layer w0.254: KEY30.1 72.83,27.02 KEY24.1 82.36,43.69 KEY17.1 87.12,57.98 KEY10.1 96.65,81.79 KEY3.1
  Bottom Layer w0.254: U1.29 147.07,68.96 129.56,86.47 98.57,86.47 96.65,88.39 KEY3.1
COL3: length 179.7
  Top Layer w0.254: KEY31.1 53.78,22.26 KEY25.1 63.31,43.69 KEY18.1 68.07,57.98 KEY11.1 77.6,81.79 KEY4.1
  Bottom Layer w0.254: U1.27 73.98,63.88 KEY18.1
COL4: length 192.1
  Top Layer w0.254: KEY26.1 44.26,43.69 KEY19.1 49.02,57.98 KEY12.1 58.55,81.79 KEY5.1
  Bottom Layer w0.254: KEY26.1 41.4,34.16 50.67,43.43 127.63,43.43 135.32,51.11 135.32,51.16 142.96,58.8 U1.25
COL5: length 215.6
  Top Layer w0.254: KEY27.1 25.21,43.69 KEY20.1 29.97,57.98 KEY13.1 39.5,81.79 KEY6.1
  Bottom Layer w0.254: U1.24 144.91,56.26 129.41,40.77 50.94,40.77 39.5,29.32 18.54,29.32 18.52,29.34 18.03,29.34 15.68,31.69 KEY27.1
COL6: length 243
  Top Layer w0.254: KEY7.1 20.45,81.79 KEY14.1 10.92,57.98 KEY21.1
  Bottom Layer w0.254: U1.19 165.85,52.71 ; 165.85,52.71 165.85,43.17 155.83,33.15 155.83,29.83 ; 165.85,52.71 153.42,65.15 122.94,65.15 122.3,64.52 17.46,64.52 KEY21.1
ROW0: length 139.5
  Top Layer w0.254: v1(134.11,82.9) 131.83,85.19 D1.1
  Bottom Layer w0.254: D7.1 D6.1 D5.1 D4.1 D3.1 D2.1 D1.1 ; v1(134.11,82.9) 142.97,74.04 U1.31 U1.31
ROW1: length 146.4
  Top Layer w0.254: D8.1 v1(125.22,63.09)
  Bottom Layer w0.254: v1(125.22,63.09) 126.75,61.56 148.48,61.56 U1.26 U1.26 ; D8.1 D9.1 D10.1 D11.1 D12.1 D13.1 D14.1
ROW2: length 131.9
  Top Layer w0.254: v1(140.72,51.15) 136.52,46.96 v1(129.67,46.96)
  Bottom Layer w0.254: U1.22 U1.22 140.75,51.18 v1(140.72,51.15) ; v1(129.67,46.96) 119.25,46.96 D15.1 D16.1 D17.1 D18.1 D19.1 D20.1 D21.1
ROW3: length 152.9
  Bottom Layer w0.254: U1.21 U1.21 143.54,48.64 130.05,35.15 128.52,35.15 127.51,36.16 116.84,36.16 D22.1 D23.1 D24.1 D26.1 D27.1
ROW4: length 183.7
  Top Layer w0.254: D28.1 145,8.98 167.39,31.37 167.39,47.75 ; 167.39,47.75 U1.20 ; 167.39,47.75 161.67,42.04 155.32,42.04 151.35,46.01 148.84,46.01
  Bottom Layer w0.254: D31.1 D30.1 D29.1 D28.1
SCL0: length 184.7
  Top Layer w0.254: v1(144.58,57.98) 144.58,61.4 148.34,65.15 150.88,65.15 U1.7 ; CN1.3 35.5,6.17 36.7,7.37 53.85,7.37 69.6,23.11 69.6,33.29 79.05,42.74 v1(80.57,42.74)
  Bottom Layer w0.254: v1(80.57,42.74) 129.34,42.74 136.1,49.5 137.01,49.5 137.7,50.19 137.7,51.1 v1(144.58,57.98)
SCL1: length 2.4
  Bottom Layer w0.254: U1.10 167.13,72.89 v1(166.37,72.89)
SDA0: length 177
  Top Layer w0.254: U1.6 151.01,67.82 148.9,67.82 v1(142.04,60.97) ; CN1.4 23.12,10.17 32.09,19.13 34.5,19.13 61.14,45.78 v1(61.14,48.01)
  Bottom Layer w0.254: v1(142.04,60.97) 87.43,60.97 80.57,54.11 67.3,54.11 61.2,48.01 v1(61.14,48.01)
SDA1: length 2.4
  Bottom Layer w0.254: U1.9 167.13,75.43 v1(166.37,75.43)
$1N158: length 12.1
  Bottom Layer w0.254: D1.2 141.06,93.88 KEY1.2
$1N243: length 12.1
  Bottom Layer w0.254: D2.2 122.01,93.88 KEY2.2
$1N305: length 12.1
  Bottom Layer w0.254: KEY3.2 102.97,93.88 D3.2
$1N549: length 12.1
  Bottom Layer w0.254: KEY4.2 83.91,93.88 D4.2
$1N551: length 12.1
  Bottom Layer w0.254: D5.2 64.87,93.88 KEY5.2
$1N553: length 12.1
  Bottom Layer w0.254: D6.2 45.81,93.88 KEY6.2
$1N987: length 12.1
  Bottom Layer w0.254: D7.2 26.76,93.88 KEY7.2
$1N1409: length 14.2
  Bottom Layer w0.254: KEY8.2 136.3,74.83 D8.2
$1N1411: length 12.1
  Bottom Layer w0.254: KEY9.2 112.49,74.83 D9.2
$1N1413: length 12.1
  Bottom Layer w0.254: D10.2 93.44,74.83 KEY10.2
$1N1415: length 12.1
  Bottom Layer w0.254: KEY11.2 74.39,74.83 D11.2
$1N1417: length 12.1
  Bottom Layer w0.254: KEY12.2 55.34,74.83 D12.2
$1N1419: length 12.1
  Bottom Layer w0.254: D13.2 24.29,74.8 KEY13.2
$1N1421: length 12.1
  Bottom Layer w0.254: D14.2 5.24,74.8 KEY14.2
$1N1843: length 14.8
  Bottom Layer w0.254: 133.95,55.75 133.92,55.78 D15.2
$1N1845: length 7
  Bottom Layer w0.254: KEY16.2 114.73,55.75 D16.2
$1N1847: length 7
  Bottom Layer w0.254: D17.2 95.68,55.75 KEY17.2
$1N1849: length 7
  Bottom Layer w0.254: KEY18.2 76.63,55.75 D18.2
$1N1851: length 7
  Bottom Layer w0.254: KEY19.2 57.58,55.75 D19.2
$1N1853: length 7
  Bottom Layer w0.254: KEY20.2 38.53,55.75 D20.2
$1N1855: length 7
  Bottom Layer w0.254: D21.2 19.48,55.75 KEY21.2
$1N2217: length 20.5
  Bottom Layer w0.254: D22.2 129.16,36.73 KEY22.2
$1N2219: length 12.1
  Bottom Layer w0.254: KEY23.2 98.2,36.73 D23.2
$1N2221: length 12.1
  Bottom Layer w0.254: D24.2 67.09,36.7 KEY24.2
$1N2223: length 11.1
  Bottom Layer w0.254: D25.2 60.1,36.73 KEY25.2
$1N2225: length 12.1
  Bottom Layer w0.254: KEY26.2 41.05,36.73 D26.2
$1N2227: length 16
  Bottom Layer w0.254: D27.2 22,36.73 KEY27.2
$1N2529: length 14.8
  Bottom Layer w0.254: D28.2 138.68,17.69 KEY28.2
$1N2531: length 14.6
  Bottom Layer w0.254: D29.2 114.87,17.69 KEY29.2
$1N4626: length 14.4
  Bottom Layer w0.254: KEY30.2 91.06,17.69 D30.2
$1N4628: length 20.2
  Bottom Layer w0.254: D31.2 37.73,17.69 37.74,17.68 39.3,17.68 39.3,17.69 52.96,17.69 52.99,17.65
$1N26639: length 20.4
  Top Layer w0.254: 160.91,29.83 158.38,27.3 153.54,27.3 148.84,32 D32.2

## Copper pours and planes (outline as drawn; the poured copper is in the pictures)
GND on Top Layer: -15.11,111.12 188.98,111.12 188.98,-19.81 -15.11,-19.81
GND on Bottom Layer: -14.73,110.87 188.59,110.87 188.59,-19.81 -14.73,-19.81

## Text on the board
Top Silkscreen Layer: itzshubhamdev | Right

# Board PCB1
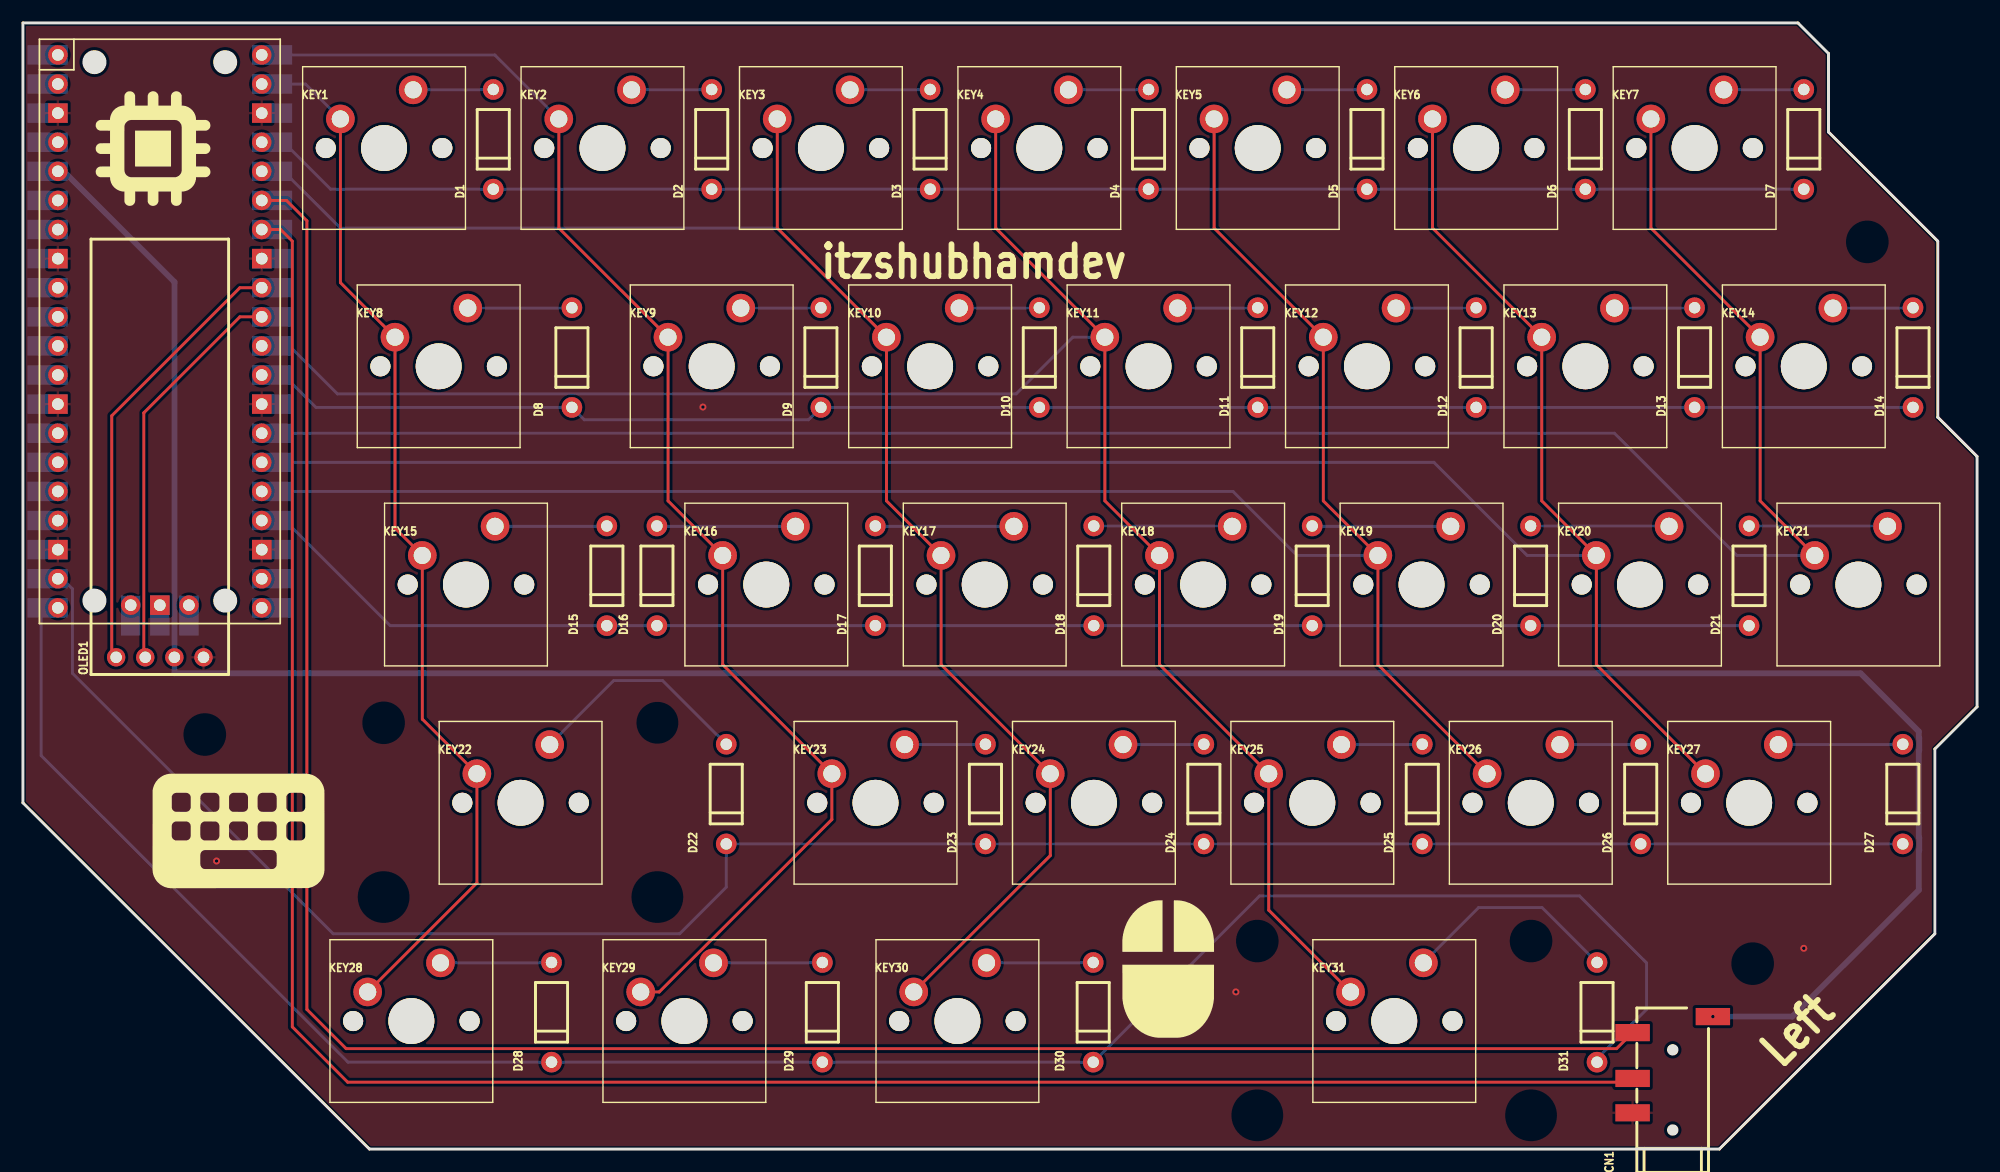
[diagram p4: board, top side]
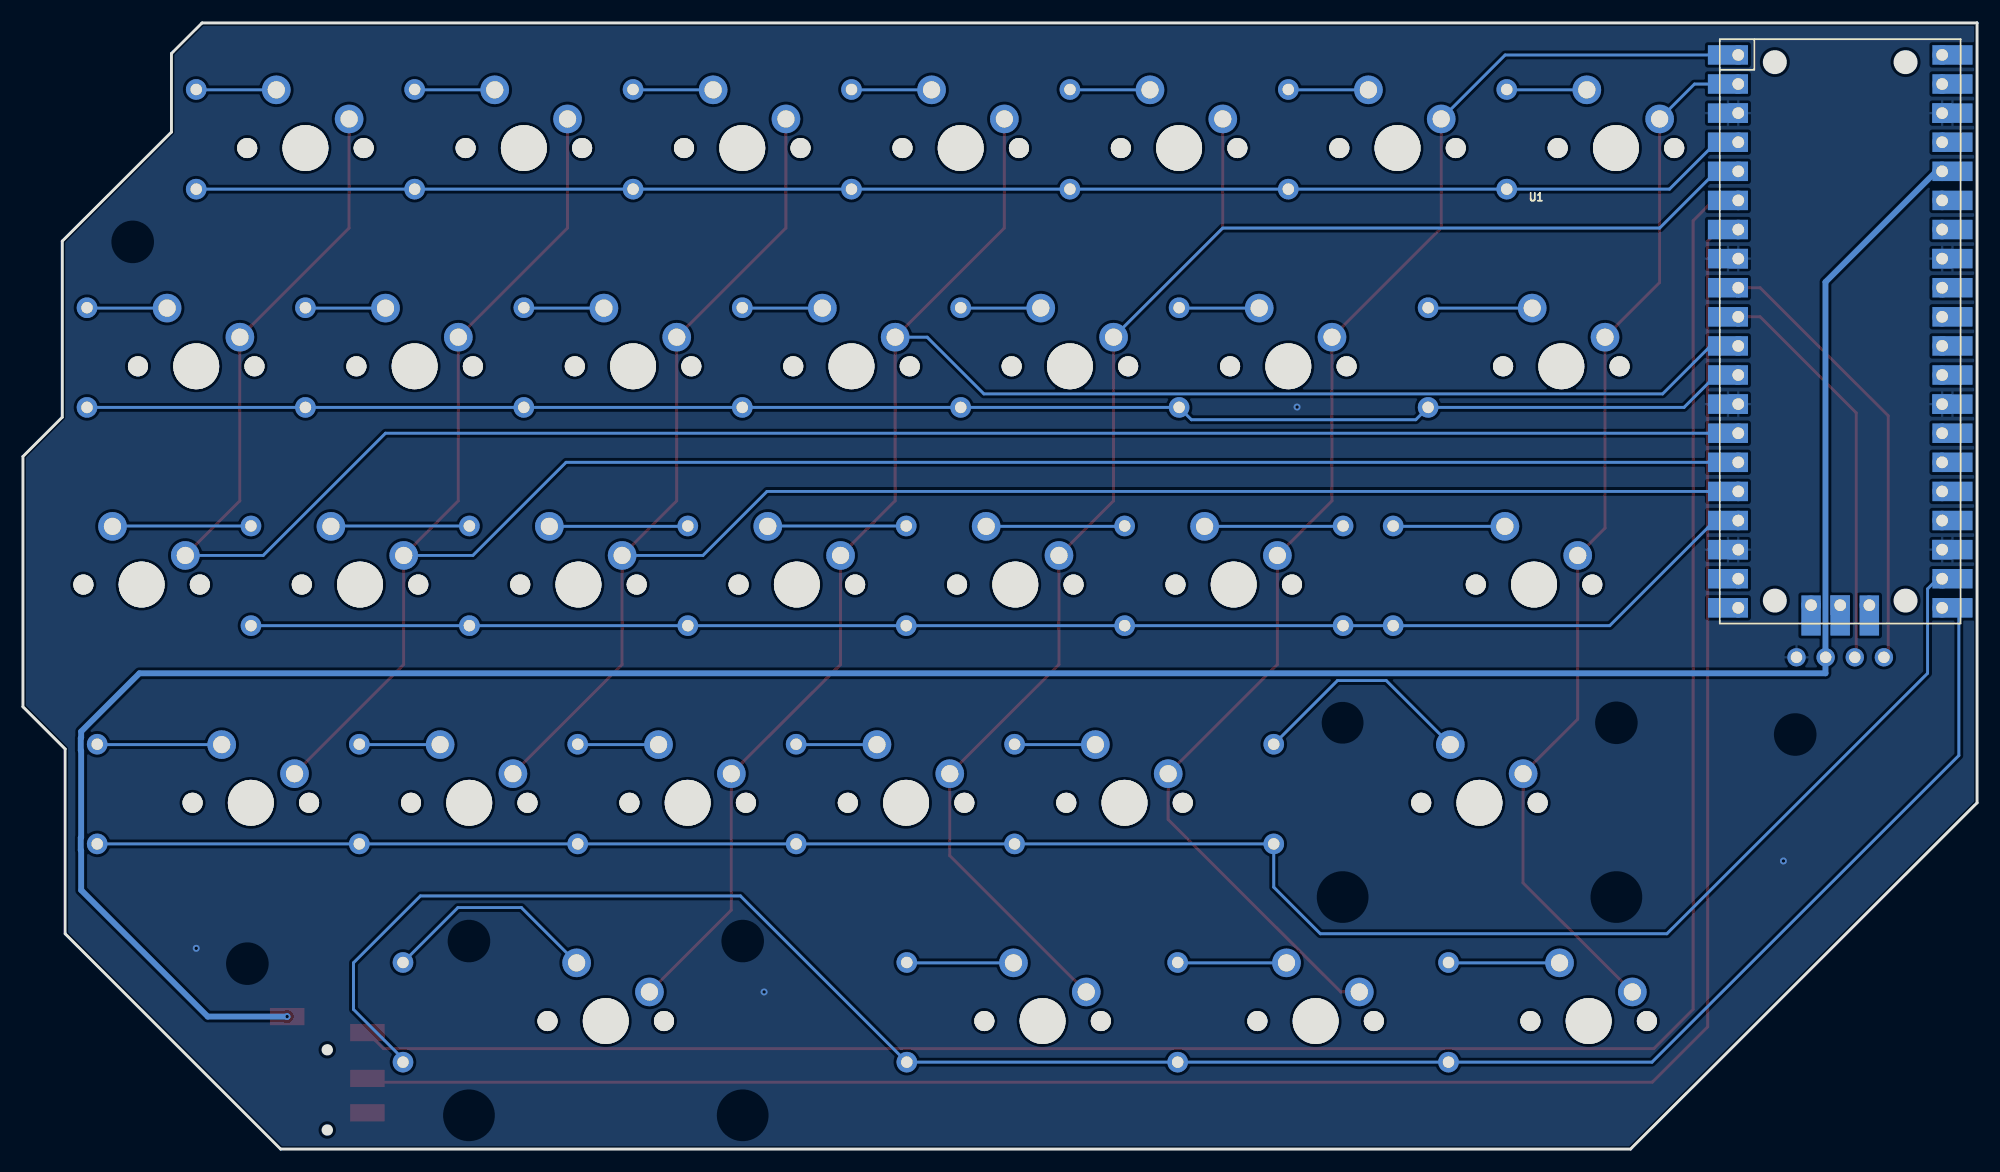
[diagram p5: board, bottom side, seen from below]

Outline 170.43 x 98.3 mm; copper layers: Top Layer, Bottom Layer. Coordinates in mm from the lower left corner of the outline.
Outline path: 0,98.3 154.81,98.3 157.48,95.63 157.48,88.77 167,79.25 167,63.88 170.43,60.45 170.43,38.61 166.75,34.93 166.75,18.8 147.95,0 30.23,0 0,30.23 0,98.3
Stack: Top Layer 0.035mm / Dielectric1 1.51mm FR4 er 4.5 / Bottom Layer 0.035mm

## Design rules (mm)
template: JLCPCB Capability(Two Layers Board)
spacing copperThickness1oz (default): track to track 0.102, other pairs 0.152 to 0.3
spacing copperThickness2oz: track to track 0.203, other pairs 0.152 to 0.3
track width copperThickness1oz (default): min 0.127, default 0.254, max 2.54
track width copperThickness2oz: min 0.203, default 0.254, max 2.54
differential pair differentialPair (default): width min 0.127, default 0.254, max 2.54; gap min 0.152, default 0.152
via viaSize (default): diameter min 0.5, default 0.61, max 10; hole min 0.3, default 0.305, max 6.3

## Placement (name value [footprint] x y rotation side)
CN1  PJ-320D  [AUDIO-SMD_PJ-320D-1]  143.89 7.37 90 top
D1  -  [DO-41_BD2.4-L4.7-P8.70-D0.9-RD]  41.02 88.14 90 top
D2  -  [DO-41_BD2.4-L4.7-P8.70-D0.9-RD]  60.07 88.14 90 top
D3  -  [DO-41_BD2.4-L4.7-P8.70-D0.9-RD]  79.12 88.14 90 top
D4  -  [DO-41_BD2.4-L4.7-P8.70-D0.9-RD]  98.17 88.14 90 top
D5  -  [DO-41_BD2.4-L4.7-P8.70-D0.9-RD]  117.22 88.14 90 top
D6  -  [DO-41_BD2.4-L4.7-P8.70-D0.9-RD]  136.27 88.14 90 top
D7  -  [DO-41_BD2.4-L4.7-P8.70-D0.9-RD]  155.32 88.14 90 top
D8  -  [DO-41_BD2.4-L4.7-P8.70-D0.9-RD]  47.88 69.09 90 top
D9  -  [DO-41_BD2.4-L4.7-P8.70-D0.9-RD]  69.6 69.09 90 top
D10  -  [DO-41_BD2.4-L4.7-P8.70-D0.9-RD]  88.65 69.09 90 top
D11  -  [DO-41_BD2.4-L4.7-P8.70-D0.9-RD]  107.7 69.09 90 top
D12  -  [DO-41_BD2.4-L4.7-P8.70-D0.9-RD]  126.75 69.09 90 top
D13  -  [DO-41_BD2.4-L4.7-P8.70-D0.9-RD]  145.8 69.09 90 top
D14  -  [DO-41_BD2.4-L4.7-P8.70-D0.9-RD]  164.85 69.09 90 top
D15  -  [DO-41_BD2.4-L4.7-P8.70-D0.9-RD]  50.93 50.04 90 top
D16  -  [DO-41_BD2.4-L4.7-P8.70-D0.9-RD]  55.29 50.04 90 top
D17  -  [DO-41_BD2.4-L4.7-P8.70-D0.9-RD]  74.34 50.04 90 top
D18  -  [DO-41_BD2.4-L4.7-P8.70-D0.9-RD]  93.39 50.04 90 top
D19  -  [DO-41_BD2.4-L4.7-P8.70-D0.9-RD]  112.44 50.04 90 top
D20  -  [DO-41_BD2.4-L4.7-P8.70-D0.9-RD]  131.49 50.04 90 top
D21  -  [DO-41_BD2.4-L4.7-P8.70-D0.9-RD]  150.54 50.04 90 top
D22  -  [DO-41_BD2.4-L4.7-P8.70-D0.9-RD]  61.34 30.99 90 top
D23  -  [DO-41_BD2.4-L4.7-P8.70-D0.9-RD]  83.95 30.99 90 top
D24  -  [DO-41_BD2.4-L4.7-P8.70-D0.9-RD]  103 30.99 90 top
D25  -  [DO-41_BD2.4-L4.7-P8.70-D0.9-RD]  122.05 30.99 90 top
D26  -  [DO-41_BD2.4-L4.7-P8.70-D0.9-RD]  141.1 30.99 90 top
D27  -  [DO-41_BD2.4-L4.7-P8.70-D0.9-RD]  163.96 30.99 90 top
D28  -  [DO-41_BD2.4-L4.7-P8.70-D0.9-RD]  46.1 11.94 90 top
D29  -  [DO-41_BD2.4-L4.7-P8.70-D0.9-RD]  69.72 11.94 90 top
D30  -  [DO-41_BD2.4-L4.7-P8.70-D0.9-RD]  93.34 11.94 90 top
D31  -  [DO-41_BD2.4-L4.7-P8.70-D0.9-RD]  137.29 11.94 90 top
KEY1  28115182DM  [MX_PCB_1.00u]  31.5 87.38 0 top
KEY2  28115182DM  [MX_PCB_1.00u]  50.55 87.38 0 top
KEY3  28115182DM  [MX_PCB_1.00u]  69.6 87.38 0 top
KEY4  28115182DM  [MX_PCB_1.00u]  88.65 87.38 0 top
KEY5  28115182DM  [MX_PCB_1.00u]  107.7 87.38 0 top
KEY6  28115182DM  [MX_PCB_1.00u]  126.75 87.38 0 top
KEY7  28115182DM  [MX_PCB_1.00u]  145.8 87.38 0 top
KEY8  28115182DM  [MX_PCB_1.00u]  36.26 68.33 0 top
KEY9  28115182DM  [MX_PCB_1.00u]  60.07 68.33 0 top
KEY10  28115182DM  [MX_PCB_1.00u]  79.12 68.33 0 top
KEY11  28115182DM  [MX_PCB_1.00u]  98.17 68.33 0 top
KEY12  28115182DM  [MX_PCB_1.00u]  117.22 68.33 0 top
KEY13  28115182DM  [MX_PCB_1.00u]  136.27 68.33 0 top
KEY14  28115182DM  [MX_PCB_1.00u]  155.32 68.33 0 top
KEY15  28115182DM  [MX_PCB_1.00u]  38.64 49.28 0 top
KEY16  28115182DM  [MX_PCB_1.00u]  64.83 49.28 0 top
KEY17  28115182DM  [MX_PCB_1.00u]  83.88 49.28 0 top
KEY18  28115182DM  [MX_PCB_1.00u]  102.93 49.28 0 top
KEY19  28115182DM  [MX_PCB_1.00u]  121.98 49.28 0 top
KEY20  28115182DM  [MX_PCB_1.00u]  141.03 49.28 0 top
KEY21  28115182DM  [MX_PCB_1.00u]  160.08 49.28 0 top
KEY22  28115182DM  [MX_PCB_1.00u]  43.4 30.23 0 top
KEY23  28115182DM  [MX_PCB_1.00u]  74.36 30.23 0 top
KEY24  28115182DM  [MX_PCB_1.00u]  93.41 30.23 0 top
KEY25  28115182DM  [MX_PCB_1.00u]  112.46 30.23 0 top
KEY26  28115182DM  [MX_PCB_1.00u]  131.51 30.23 0 top
KEY27  28115182DM  [MX_PCB_1.00u]  150.56 30.23 0 top
KEY28  28115182DM  [MX_PCB_1.00u]  33.88 11.18 0 top
KEY29  28115182DM  [MX_PCB_1.00u]  57.69 11.18 0 top
KEY30  28115182DM  [MX_PCB_1.00u]  81.5 11.18 0 top
KEY31  28115182DM  [MX_PCB_1.00u]  119.6 11.18 0 top
OLED1  HS91L02W2C01  [OLED-TH_L38.0-W12.0_HS91L02W2C01]  11.94 42.93 90 top
U1  PICO  [Raspberry_Pi_Pico]  11.94 71.37 180 bottom

## Footprints (pads in the part's own frame, mm; a bottom-side part is the same pattern mirrored in y, then rotated)
AUDIO-SMD_PJ-320D-1
  rect 1.5x3 smd: 1(4.2,-3.5) 2(-4.2,3.5) 3(-1.2,3.5) 4(2.8,3.5)
DO-41_BD2.4-L4.7-P8.70-D0.9-RD
  round 1.8 hole 1: 1(-4.35,0) 2(4.35,0)
MX_PCB_1.00u
  round 1.75 hole 1.75: (-5.08,0) (5.08,0)
  round 4 hole 4: (0,0)
  round 2.5 hole 1.5: 1(-3.81,2.54) 2(2.54,5.08)
OLED-TH_L38.0-W12.0_HS91L02W2C01
  round 1.6 hole 1: 1(0,-3.81) 2(0,-1.27) 3(0,1.27) 4(0,3.81)
Raspberry_Pi_Pico
  rect 3.5x1.7 smd: 1(-9.79,24.13) 2(-9.79,21.59) 3(-9.79,19.05) 4(-9.79,16.51) 5(-9.79,13.97) 6(-9.79,11.43) 7(-9.79,8.89) 8(-9.79,6.35) 9(-9.79,3.81) 10(-9.79,1.27) 11(-9.79,-1.27) 12(-9.79,-3.81) 13(-9.79,-6.35) 14(-9.79,-8.89) 15(-9.79,-11.43) 16(-9.79,-13.97) 17(-9.79,-16.51) 18(-9.79,-19.05) 19(-9.79,-21.59) 20(-9.79,-24.13) 21(9.79,-24.13) 22(9.79,-21.59) 23(9.79,-19.05) 24(9.79,-16.51) 25(9.79,-13.97) 26(9.79,-11.43) 27(9.79,-8.89) 28(9.79,-6.35) 29(9.79,-3.81) 30(9.79,-1.27) 31(9.79,1.27) 32(9.79,3.81) 33(9.79,6.35) 34(9.79,8.89) 35(9.79,11.43) 36(9.79,13.97) 37(9.79,16.51) 38(9.79,19.05) 39(9.79,21.59) 40(9.79,24.13)
  round 1.7 hole 1.02: 1(-8.89,24.13) 2(-8.89,21.59) 4(-8.89,16.51) 5(-8.89,13.97) 6(-8.89,11.43) 7(-8.89,8.89) 9(-8.89,3.81) 10(-8.89,1.27) 11(-8.89,-1.27) 12(-8.89,-3.81) 14(-8.89,-8.89) 15(-8.89,-11.43) 16(-8.89,-13.97) 17(-8.89,-16.51) 19(-8.89,-21.59) 20(-8.89,-24.13) 21(8.89,-24.13) 22(8.89,-21.59) 24(8.89,-16.51) 25(8.89,-13.97) 26(8.89,-11.43) 27(8.89,-8.89) 29(8.89,-3.81) 30(8.89,-1.27) 31(8.89,1.27) 32(8.89,3.81) 34(8.89,8.89) 35(8.89,11.43) 36(8.89,13.97) 37(8.89,16.51) 39(8.89,21.59) 40(8.89,24.13) 41(-2.54,-23.9) 43(2.54,-23.9)
  rect 1.7x1.7 hole 1.02: 3(-8.89,19.05) 8(-8.89,6.35) 13(-8.89,-6.35) 18(-8.89,-19.05) 23(8.89,-19.05) 28(8.89,-6.35) 33(8.89,6.35) 38(8.89,19.05) 42(0,-23.9)
  rect 1.7x3.5 smd: 41(-2.54,-24.8) 42(0,-24.8) 43(2.54,-24.8)

## Nets
As in the schematic.

Pads without a net: U1 19 20 24 25 26 27 29 30 31 32 34 35 37 39 40 41 42 43

## Via types
v1: diameter 0.61, hole 0.305, Top Layer to Bottom Layer, 5 vias

## Routing (per net, layer and track width the routed paths; a pad name or vN(x,y) marks a point on that pad's centre or on a via; arc(x,y) is an arc through that point)
GND:
  vias: v1(16.89,25.15) v1(59.31,64.77) v1(105.79,13.72) v1(155.32,17.53)
VCC: length 240.5
  Bottom Layer w0.508: 1.59,85.34 3.56,85.34 13.22,75.68 13.22,41.53 160.27,41.53 165.35,36.45 165.35,35.92 165.39,35.88 165.39,34.8 165.35,34.76 165.35,27.22 165.39,27.18 165.39,26.1 165.35,26.06 165.35,22.61 154.31,11.57 v1(147.39,11.57)
COL0: length 93.3
  Top Layer w0.254: 30.07,13.72 39.6,23.24 39.6,32.77 34.83,37.53 34.83,51.82 32.45,54.2 32.45,70.87 27.69,75.63 27.69,89.92
  Bottom Layer w0.254: 20.76,92.96 24.65,92.96 27.69,89.92
COL1: length 122.2
  Top Layer w0.254: 46.74,89.92 46.74,80.39 56.27,70.87 56.27,56.58 61.03,51.82 61.03,42.29 70.55,32.77 70.55,28.77 55.5,13.72 53.88,13.72
  Bottom Layer w0.254: 20.76,95.5 41.16,95.5 46.74,89.92
COL2: length 151.5
  Top Layer w0.254: 77.7,13.72 89.6,25.62 89.6,32.77 80.08,42.29 80.08,51.82 75.32,56.58 75.32,70.87 65.79,80.39 65.79,89.92
  Bottom Layer w0.254: 20.76,85.34 22.74,85.34 27.69,80.39 65.79,80.39 75.32,70.87
COL3: length 166.4
  Top Layer w0.254: 84.84,89.92 84.84,80.39 94.37,70.87 94.37,56.58 99.13,51.82 99.13,42.29 108.65,32.77 108.65,20.86 115.8,13.72
  Bottom Layer w0.254: 94.37,70.87 91.57,70.87 86.62,65.92 27.43,65.92 23.24,70.1 20.76,70.1
COL4: length 166.7
  Top Layer w0.254: 127.7,32.77 118.18,42.29 118.18,51.82 113.42,56.58 113.42,70.87 103.89,80.39 103.89,89.92
  Bottom Layer w0.254: 118.18,51.82 111.12,51.82 105.54,57.4 20.77,57.4 20.76,57.4
COL5: length 186.8
  Top Layer w0.254: 122.94,89.92 122.94,80.39 132.47,70.87 132.47,56.58 137.23,51.82 137.23,42.29 146.75,32.77
  Bottom Layer w0.254: 20.76,59.94 20.77,59.94 123.06,59.94 131.19,51.82 137.23,51.82
COL6: length 184
  Top Layer w0.254: 156.28,51.82 151.52,56.58 151.52,70.87 141.99,80.39 141.99,89.92
  Bottom Layer w0.254: 156.28,51.82 149.48,51.82 138.81,62.48 20.77,62.48 20.76,62.48
ROW0: length 136.3
  Bottom Layer w0.254: D7.1 D6.1 D5.1 D4.1 D3.1 D2.1 D1.1 26.83,83.79 22.99,87.63 21.01,87.63 20.76,87.88
ROW1: length 146.1
  Bottom Layer w0.254: 20.76,67.56 22.74,67.56 25.56,64.74 D8.1 48.96,63.66 68.52,63.66 D9.1 D10.1 D11.1 D12.1 D13.1 D14.1
ROW2: length 133.6
  Bottom Layer w0.254: 20.76,54.86 20.77,54.86 22.86,54.86 32.04,45.69 D15.1 D16.1 D17.1 D18.1 D19.1 D20.1 D21.1
ROW3: length 185
  Bottom Layer w0.254: D27.1 D26.1 D25.1 D24.1 D23.1 D22.1 61.34,22.86 57.28,18.8 27.05,18.8 4.32,41.53 4.32,48.9 3.43,49.78 1.59,49.78
ROW4: length 182.9
  Bottom Layer w0.254: D31.1 137.29,7.87 141.6,12.19 141.6,16.26 135.76,22.1 107.85,22.1 D30.1 D29.1 D28.1 28.35,7.59 1.59,34.35 1.59,47.24
SCL0: length 190.8
  Top Layer w0.254: CN1.3 140.07,5.84 28.32,5.84 23.49,10.67 23.49,79.25 22.48,80.26 20.76,80.26
SCL1: length 35.1
  Top Layer w0.254: OLED1.3 10.54,43.05 10.54,64.26 18.92,72.64 U1.10
SDA0: length 191.2
  Top Layer w0.254: CN1.4 138.99,8.77 28.19,8.77 24.76,12.19 24.76,81.03 22.99,82.8 20.76,82.8
SDA1: length 38.9
  Top Layer w0.254: 20.76,75.18 20.76,75.18 18.92,75.18 7.75,64.01 7.75,43.31 OLED1.4
$1N158: length 7
  Bottom Layer w0.254: 34.03,92.46 40.99,92.46 D1.2
$1N243: length 7
  Bottom Layer w0.254: D2.2 60.04,92.46 53.08,92.46
$1N305: length 7
  Bottom Layer w0.254: 72.13,92.46 79.09,92.46 D3.2
$1N549: length 7
  Bottom Layer w0.254: 91.18,92.46 98.14,92.46 D4.2
$1N551: length 7
  Bottom Layer w0.254: D5.2 117.19,92.46 110.23,92.46
$1N553: length 7
  Bottom Layer w0.254: 129.28,92.46 136.24,92.46 D6.2
$1N987: length 7
  Bottom Layer w0.254: D7.2 155.29,92.46 148.33,92.46
$1N1409: length 9.1
  Bottom Layer w0.254: 38.79,73.41 47.85,73.41 D8.2
$1N1411: length 7
  Bottom Layer w0.254: D9.2 69.56,73.41 62.61,73.41
$1N1413: length 7
  Bottom Layer w0.254: D10.2 88.61,73.41 81.66,73.41
$1N1415: length 7
  Bottom Layer w0.254: D11.2 107.66,73.41 100.71,73.41
$1N1417: length 7
  Bottom Layer w0.254: 119.76,73.41 126.71,73.41 D12.2
$1N1419: length 7
  Bottom Layer w0.254: 138.81,73.41 145.76,73.41 D13.2
$1N1421: length 7
  Bottom Layer w0.254: D14.2 164.81,73.41 157.86,73.41
$1N1843: length 9.8
  Bottom Layer w0.254: 41.17,54.36 50.9,54.36 D15.2
$1N1845: length 12.1
  Bottom Layer w0.254: D16.2 55.33,54.36 67.37,54.36
$1N1847: length 12.1
  Bottom Layer w0.254: D17.2 74.38,54.36 86.42,54.36
$1N1849: length 12.1
  Bottom Layer w0.254: 105.47,54.36 105.44,54.39 D18.2
$1N1851: length 12.1
  Bottom Layer w0.254: 124.52,54.36 112.48,54.36 D19.2
$1N1853: length 12.1
  Bottom Layer w0.254: D20.2 143.54,54.39 143.57,54.36
$1N1855: length 12.1
  Bottom Layer w0.254: D21.2 162.59,54.39 162.62,54.36
$1N2217: length 20
  Bottom Layer w0.254: 45.94,35.31 51.53,40.89 55.79,40.89 D22.2
$1N2219: length 7.1
  Bottom Layer w0.254: D23.2 83.91,35.31 76.89,35.31
$1N2221: length 7.1
  Bottom Layer w0.254: D24.2 102.97,35.31 95.94,35.31
$1N2223: length 7.1
  Bottom Layer w0.254: 114.99,35.31 122.01,35.31 D25.2
$1N2225: length 7.1
  Bottom Layer w0.254: 134.04,35.31 141.06,35.31 D26.2
$1N2227: length 10.9
  Bottom Layer w0.254: 153.09,35.31 163.92,35.31 D27.2
$1N2529: length 9.7
  Bottom Layer w0.254: 36.41,16.26 46.07,16.26 D28.2
$1N2531: length 9.5
  Bottom Layer w0.254: 60.23,16.26 69.69,16.26 D29.2
$1N4626: length 9.3
  Bottom Layer w0.254: D30.2 93.31,16.26 84.04,16.26
$1N4628: length 19.1
  Bottom Layer w0.254: 122.14,16.26 126.96,21.08 132.49,21.08 D31.2

## Copper pours and planes (outline as drawn; the poured copper is in the pictures)
GND on Top Layer: -2.16,98.81 175.64,98.81 175.64,-6.6 -2.16,-6.6
GND on Bottom Layer: -2.16,98.81 175.64,98.81 175.64,-6.6 -2.16,-6.6

## Text on the board
Top Silkscreen Layer: itzshubhamdev | Left
